# Altium project DAQ_Replacement.PrjPcb (part 2 of 3)

## Sheet MCU_DAQ.SchDoc
size A3
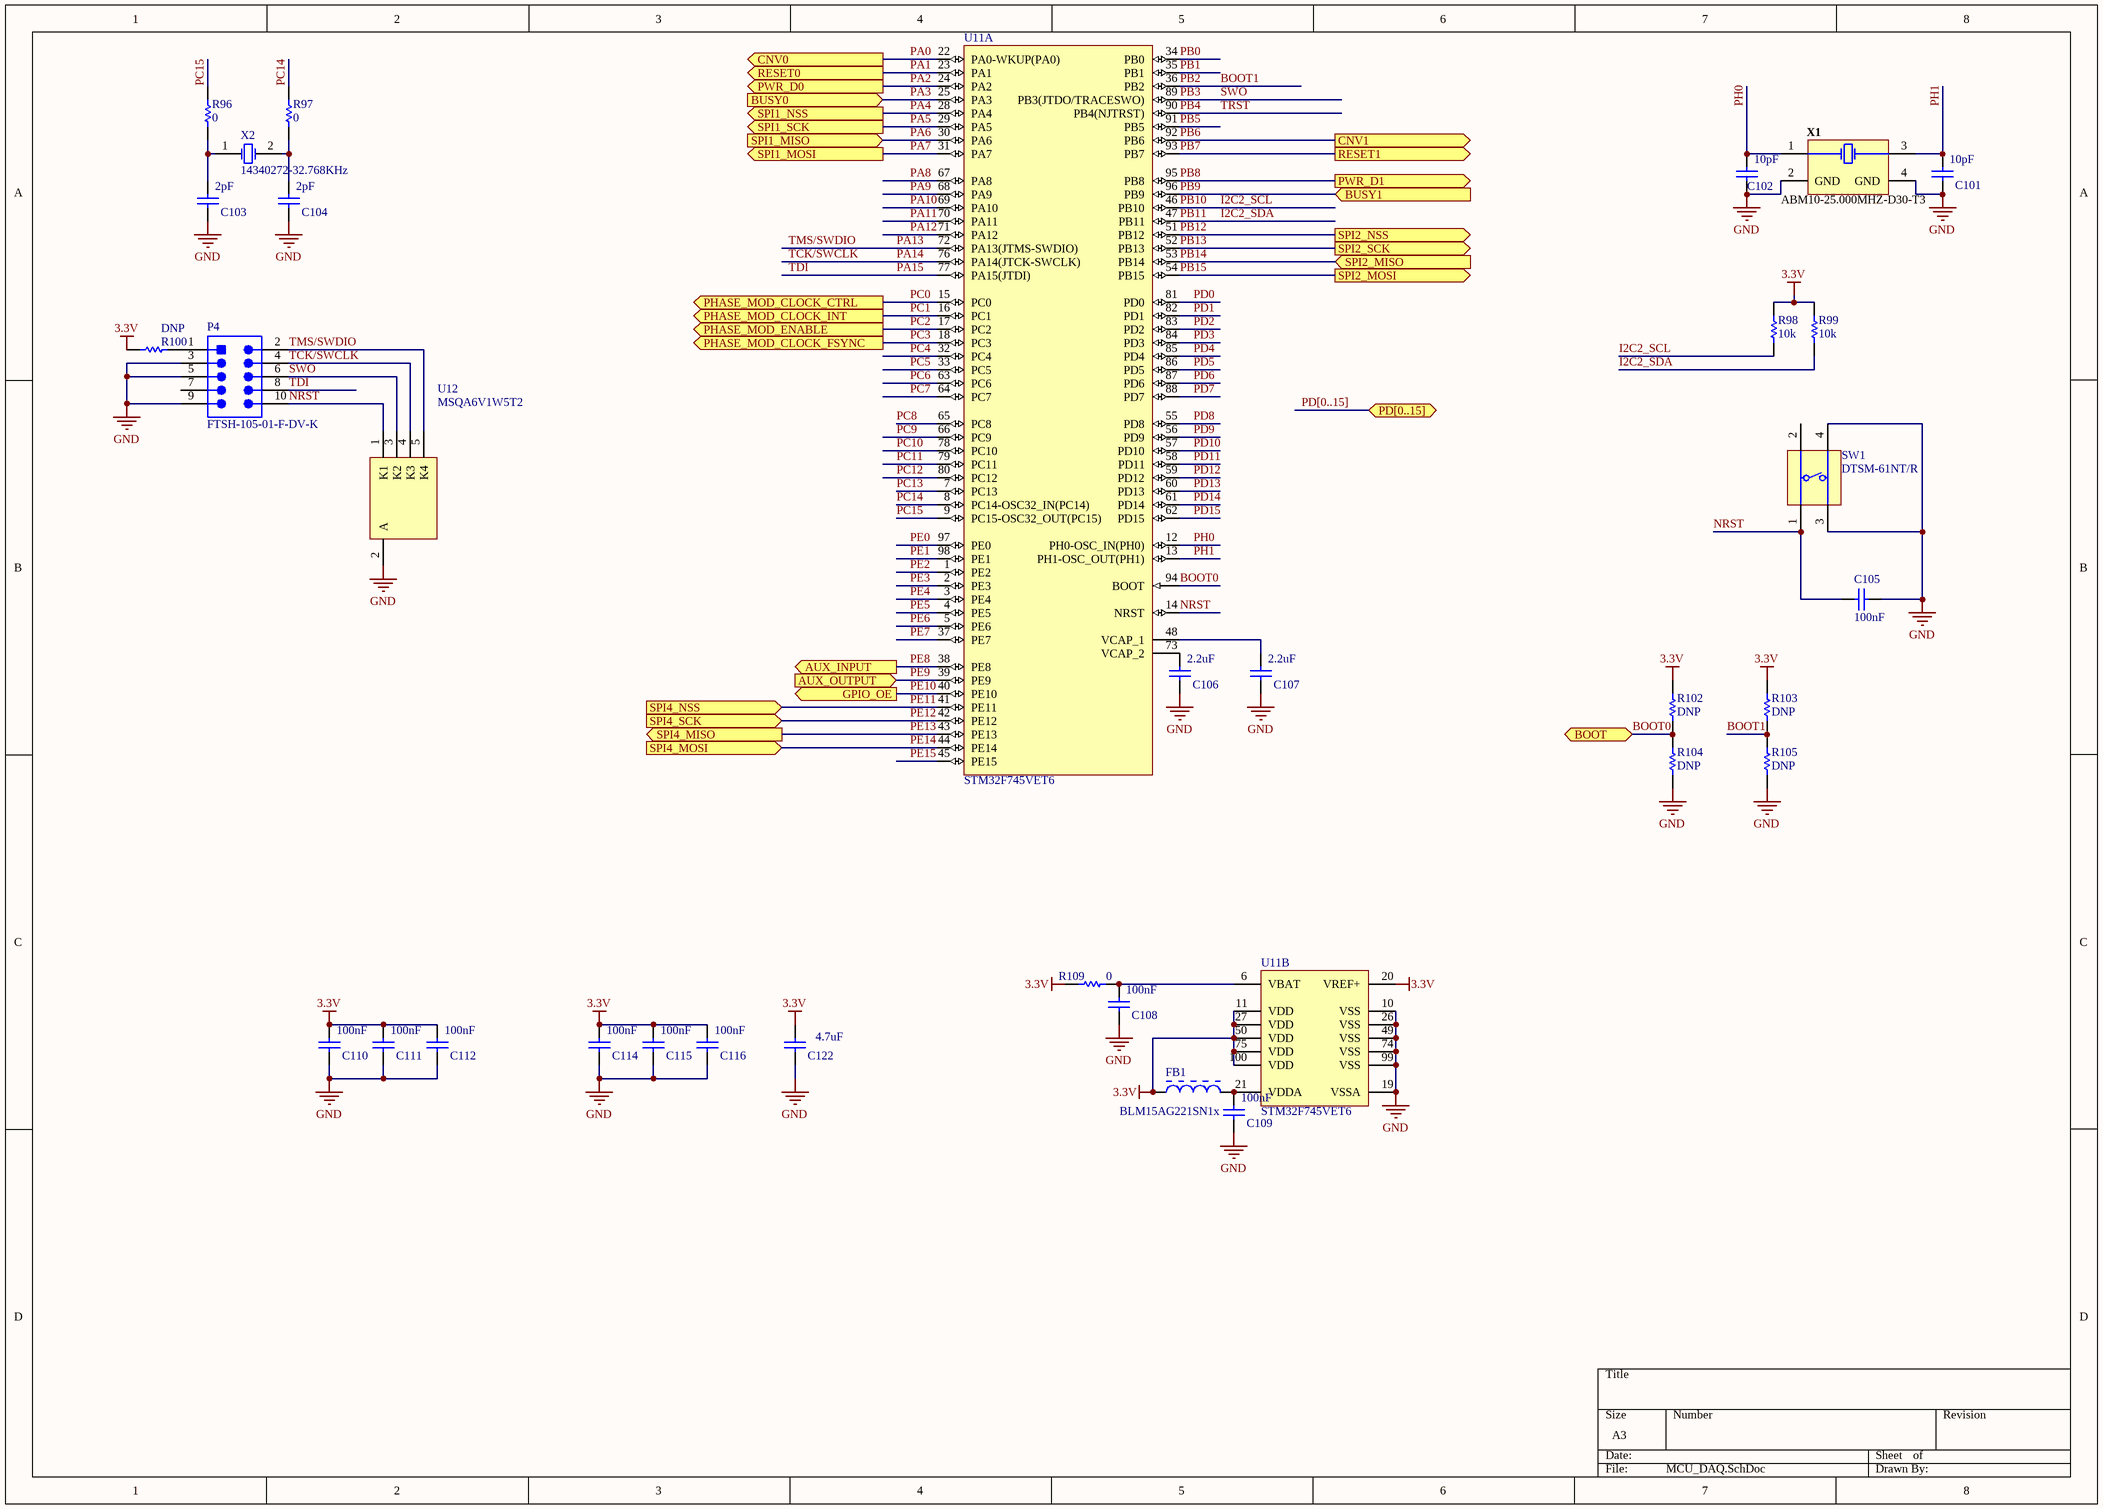
[diagram p8: MCU_DAQ.SchDoc]

### Parts
C101  value 10pF  [CAPC0402(1005)60_L]  (hidden comment: CAP0402)
C102  value 10pF  [CAPC0402(1005)60_L]  (hidden comment: CAP0402)
C103  value 2pF  [CAPC0402(1005)60_L]  (hidden comment: CAP0402)
C104  value 2pF  [CAPC0402(1005)60_L]  (hidden comment: CAP0402)
C105  value 100nF  [CAPC0402(1005)60_L]  (hidden comment: CAP0402)
C106  value 2.2uF  [CAPC0402(1005)60_L]  (hidden comment: CAP0402)
C107  value 2.2uF  [CAPC0402(1005)60_L]  (hidden comment: CAP0402)
C108  value 100nF  [CAPC0402(1005)60_L]  (hidden comment: CAP0402)
C109  value 100nF  [CAPC0402(1005)60_L]  (hidden comment: CAP0402)
C110  value 100nF  [CAPC0402(1005)60_L]  (hidden comment: CAP0402)
C111  value 100nF  [CAPC0402(1005)60_L]  (hidden comment: CAP0402)
C112  value 100nF  [CAPC0402(1005)60_L]  (hidden comment: CAP0402)
C114  value 100nF  [CAPC0402(1005)60_L]  (hidden comment: CAP0402)
C115  value 100nF  [CAPC0402(1005)60_L]  (hidden comment: CAP0402)
C116  value 100nF  [CAPC0402(1005)60_L]  (hidden comment: CAP0402)
C122  value 4.7uF  [CAPC0805(2012)145_L]  (hidden comment: CAP0805)
FB1  BLM15AG221SN1x  [MURA-BLM15AG221SN1x_V]
P4  FTSH-105-01-F-DV-K  [SMTC-FTSH-105-01-L-DV-K_V]
R96  value 0  [RESC0402(1005)_L]  (hidden comment: RES0402)
R97  value 0  [RESC0402(1005)_L]  (hidden comment: RES0402)
R98  value 10k  [RESC0402(1005)_L]  (hidden comment: RES0402)
R99  value 10k  [RESC0402(1005)_L]  (hidden comment: RES0402)
R100  value DNP  [RESC0402(1005)_L]  (hidden comment: RES0402)
R102  value DNP  [RESC0402(1005)_L]  (hidden comment: RES0402)
R103  value DNP  [RESC0402(1005)_L]  (hidden comment: RES0402)
R104  value DNP  [RESC0402(1005)_L]  (hidden comment: RES0402)
R105  value DNP  [RESC0402(1005)_L]  (hidden comment: RES0402)
R109  value 0  [RESC0402(1005)_L]  (hidden comment: RES0402)
SW1  DTSM-61NT/R  [DIPT-DTSM-6_V]
U11  STM32F745VET6  [STM-LQFP100_V]  (parts A,B of 2)
U12  MSQA6V1W5T2  [ONSC-SC70-5-419A-02_V]
X1  ABM10-25.000MHZ-D30-T3  [ABRA-ABM10_V]
X2  14340272-32.768KHz  [ITTI-14340272-32.768KHz-2_V]

### Ports
AUX_INPUT (out), AUX_OUTPUT (in), BOOT, BUSY0 (in), BUSY1 (in), CNV0 (out), CNV1 (out), GPIO_OE (out), PD[0..15] (bidir), PHASE_MOD_CLOCK_CTRL (out), PHASE_MOD_CLOCK_FSYNC (out), PHASE_MOD_CLOCK_INT (out), PHASE_MOD_ENABLE (out), PWR_D0 (out), PWR_D1 (out), RESET0 (out), RESET1 (out), SPI1_MISO (in), SPI1_MOSI (out), SPI1_NSS (out), SPI1_SCK (out), SPI2_MISO (in), SPI2_MOSI (out), SPI2_NSS (out), SPI2_SCK (out), SPI4_MISO (out), SPI4_MOSI (in), SPI4_NSS (in), SPI4_SCK (in)

### Nets
3.3V: C110.1 C111.1 C112.1 C114.1 C115.1 C116.1 C122.2 FB1.1 R98.2 R99.2 R100.2 R102.2 R103.2 R109.2 U11.11(VDD) U11.20(VREF+) U11.27(VDD) U11.50(VDD) U11.75(VDD) U11.100(VDD)
GND: C101.2 C102.2 C103.2 C104.2 C105.2 C106.2 C107.2 C108.2 C109.2 C110.2 C111.2 C112.2 C114.2 C115.2 C116.2 C122.1 P4.3 P4.5 P4.9 R104.1 R105.1 SW1.3(T3) SW1.4(T3) U11.10(VSS) U11.19(VSSA) U11.26(VSS) U11.49(VSS) U11.74(VSS) U11.99(VSS) U12.2(A) X1.2(GND) X1.4(GND)
BOOT0: R102.1 R104.2 U11.94(BOOT) ; port BOOT
BOOT1: R103.1 R105.2 U11.36(PB2)  [also labelled PB2]
I2C2_SCL: R98.1 U11.46(PB10)  [also labelled PB10]
I2C2_SDA: R99.1 U11.47(PB11)  [also labelled PB11]
NRST: C105.1 P4.10 SW1.1(T1) U11.14(NRST) U12.1(K1)
PA0: U11.22(PA0-WKUP(PA0)) ; port CNV0  [project net CNV0]
PA1: U11.23(PA1) ; port RESET0
PA2: U11.24(PA2) ; port PWR_D0
PA3: U11.25(PA3) ; port BUSY0  [project net BUSY0]
PA4: U11.28(PA4) ; port SPI1_NSS  [project net CSB0]
PA5: U11.29(PA5) ; port SPI1_SCK
PA6: U11.30(PA6) ; port SPI1_MISO
PA7: U11.31(PA7) ; port SPI1_MOSI  [project net DIN0]
PA8: U11.67(PA8)
PA9: U11.68(PA9)
PA10: U11.69(PA10)
PA11: U11.70(PA11)
PA12: U11.71(PA12)
PA13: P4.2 U11.72(PA13(JTMS-SWDIO)) U12.5(K4)  [also labelled TMS/SWDIO]
PA14: P4.4 U11.76(PA14(JTCK-SWCLK)) U12.4(K3)  [also labelled TCK/SWCLK]
PA15: P4.8 U11.77(PA15(JTDI))  [also labelled TDI]
PB0: U11.34(PB0)
PB1: U11.35(PB1)
PB3: P4.6 U11.89(PB3(JTDO/TRACESWO)) U12.3(K2)  [also labelled SWO]
PB4: U11.90(PB4(NJTRST))  [also labelled TRST]
PB5: U11.91(PB5)
PB6: U11.92(PB6) ; port CNV1  [project net CNV]
PB7: U11.93(PB7) ; port RESET1
PB8: U11.95(PB8) ; port PWR_D1
PB9: U11.96(PB9) ; port BUSY1  [project net BUSY]
PB12: U11.51(PB12) ; port SPI2_NSS  [project net CSB]
PB13: U11.52(PB13) ; port SPI2_SCK
PB14: U11.53(PB14) ; port SPI2_MISO
PB15: U11.54(PB15) ; port SPI2_MOSI  [project net DIN]
PC0: U11.15(PC0) ; port PHASE_MOD_CLOCK_CTRL
PC1: U11.16(PC1) ; port PHASE_MOD_CLOCK_INT
PC2: U11.17(PC2) ; port PHASE_MOD_ENABLE
PC3: U11.18(PC3) ; port PHASE_MOD_CLOCK_FSYNC
PC4: U11.32(PC4)
PC5: U11.33(PC5)
PC6: U11.63(PC6)
PC7: U11.64(PC7)
PC8: U11.65(PC8)
PC9: U11.66(PC9)
PC10: U11.78(PC10)
PC11: U11.79(PC11)
PC12: U11.80(PC12)
PC13: U11.7(PC13)
PC14: R97.1 U11.8(PC14-OSC32_IN(PC14))
PC15: R96.1 U11.9(PC15-OSC32_OUT(PC15))
PD0: U11.81(PD0)  [project net 3V3_BUS0]
PD1: U11.82(PD1)  [project net 3V3_BUS1]
PD2: U11.83(PD2)  [project net 3V3_BUS2]
PD3: U11.84(PD3)  [project net 3V3_BUS3]
PD4: U11.85(PD4)  [project net 3V3_BUS4]
PD5: U11.86(PD5)  [project net 3V3_BUS5]
PD6: U11.87(PD6)  [project net 3V3_BUS6]
PD7: U11.88(PD7)  [project net 3V3_BUS7]
PD8: U11.55(PD8)  [project net 3V3_BUS8]
PD9: U11.56(PD9)  [project net 3V3_BUS9]
PD10: U11.57(PD10)  [project net 3V3_BUS10]
PD11: U11.58(PD11)  [project net 3V3_BUS11]
PD12: U11.59(PD12)  [project net 3V3_BUS12]
PD13: U11.60(PD13)  [project net 3V3_BUS13]
PD14: U11.61(PD14)  [project net 3V3_BUS14]
PD15: U11.62(PD15)  [project net 3V3_BUS15]
PE0: U11.97(PE0)
PE1: U11.98(PE1)
PE2: U11.1(PE2)
PE3: U11.2(PE3)
PE4: U11.3(PE4)
PE5: U11.4(PE5)
PE6: U11.5(PE6)
PE7: U11.37(PE7)
PE8: U11.38(PE8) ; port AUX_INPUT
PE9: U11.39(PE9) ; port AUX_OUTPUT
PE10: U11.40(PE10) ; port GPIO_OE  [project net GPIO_OE]
PE11: U11.41(PE11) ; port SPI4_NSS
PE12: U11.42(PE12) ; port SPI4_SCK
PE13: U11.43(PE13) ; port SPI4_MISO  [project net MISO]
PE14: U11.44(PE14) ; port SPI4_MOSI  [project net MOSI]
PE15: U11.45(PE15)
PH0: C102.1 U11.12(PH0-OSC_IN(PH0)) X1.1(X1)
PH1: C101.1 U11.13(PH1-OSC_OUT(PH1)) X1.3(X2)
NetC103_1: C103.1 R96.2 X2.1(X1)
NetC104_1: C104.1 R97.2 X2.2(X2)
NetC106_1: C106.1 U11.73(VCAP_2)
NetC107_1: C107.1 U11.48(VCAP_1)
NetC108_1: C108.1 R109.1 U11.6(VBAT)
NetC109_1: C109.1 FB1.2 U11.21(VDDA)
NetP4_1: P4.1 R100.1

Not connected (* = marked no-connect by the designer): P4 7; SW1 2(T2)

### Buses and harness runs
bus PD[0..15] = port PD[0..15]

### Library data of the parts
C101-C112 C114-C116 = CMP-1590-00004-1: as C14 on sheet ADC_Sheet; PackageReference: CAPC0402(1005)60
C122 = CMP-1590-00003-1: as C13 on sheet ADC_Sheet; PackageReference: CAPC0805(2012)145
FB1 = CMP-1662-00018-3: as FB3 on sheet Bipolar_PSU_Sheet; Package Quantity: 10000; DatasheetVersion: 03/2011; Radiation Hardening: No; Case Code (Imperial): 0402; Length: 1 mm; RoHSCompliant: True; ComponentLink1URL: http://www.murata.com/; Case/Package: 0402; Width: 0.5 mm; Mounting Technology: Surface Mount; REACH SVHC: No SVHC; Height: 0.5 mm; ComponentLink2Description: Datasheet; PartNumber: BLM15AG221SN1x; ComponentLink1Description: Manufacturer URL; Max Operating Temperature: 125 degC; PackageDescription: 2-Pin Surface Mount Device, Body 1 x 0.5 mm; Case Code (Metric): 1005; ComponentLink2URL: https://datasheet.ciiva.com/11800/0900766b811b5866-11800858.pdf; Min Operating Temperature: -55 degC
P4 = CMP-2000-05352-1: as P8 on sheet WIFI_BLE_Option; Fastening Type: -; Package Reference: FTSH-105-01-L-DV-K; Termination: Solder; Package URL: http://suddendocs.samtec.com/prints/ftsh-1xx-xx-xxx-dv-xxx-footprint.pdf; Number of Rows: 2; Contact Finish Thickness: 3µin(0.08µm); Contact Type: MalePin; Manufacturer URL: http://www.samtec.com/; Contact Mating Length: 0.120"(3.05mm); Pitch: 0.050"(1.27mm); Series: FTSH; Features: -; Contact Finish: Gold; Color: Black; Family: RectangularConnectors-Headers,MalePins; Datasheet URL: http://suddendocs.samtec.com/prints/ftsh-1xx-xx-xxx-dv-xxx-mkt.pdf; Package Description: Male Header, Pitch 1.27 mm, 2 x 5 Position, Height 5.97 mm, Tail Length 4.32 mm; Mounting Type: SurfaceMount; Datasheet Version: Rev. ET, 10/1995; Category: Connectors,Interconnects; Packaging: Tube
R96-R100 R102-R105 R109 = CMP-1591-00004-1: as R236 on sheet USB; PackageReference: RESC0402(1005)
SW1 = CMP-0306-00001-1: Switch, SPNO Push Button SMD; Manufacturer: Diptronics; Packing Type: Tape&Reel; Mechanical Life: 200,000 cycles; ComponentLink2URL: http://www.dip.com.tw/Products_tact.htm; ComponentLink1URL: http://www.dip.com.tw/; ComponentLink3URL: http://www.dip.com.tw/PDF/pro_tact/DTSM_G_-6_2_-V.pdf; PackageDescription: Switch, Through-Hole, 4 Leads, Body 8.5x8.5mm, Row Spacing 9.0mm, Pitch 4.5mm; ComponentLink2Description: Datasheet; ComponentLink3Description: Package Specification; ComponentLink1Description: Manufacturer URL; PackageReference: DTSM-6; PartNumber: DTSM-61NT/R; Mounting Technology: Through Hole
U11 = CMP-1570-00003-1: ARM-Based Cortex-M7 32 Bit MCU+FPU, 462 DMIPS, 512 kB Flash, 320 kB RAM, 82 I/Os, -40 to 85 degC, 100-Pin LQFP, Halogen-Free, Tray; L1 Cache Data Memory: 4 KByte; Supply Voltage Max: 3.6 V; Supply Voltage Min: 1.7 V; Number of I/Os: 82; Clock Frequency Max: 216 MHz; Program Memory Size: 512 KByte; Data RAM Size: 320 KByte; DatasheetVersion: Rev. 1; ComponentLink3Description: Package Specification; L1 Cache Instruction Memory: 4 KByte; ComponentLink1Description: Manufacturer URL; Mounting Technology: Surface Mount; Packing: Tray; ComponentLink3URL: http://www.st.com/st-web-ui/static/active/en/resource/technical/document/data_brief/DM00071938.pdf; ComponentLink2URL: http://www.st.com/st-web-ui/static/active/en/resource/technical/document/datasheet/DM00166116.pdf; ComponentLink1URL: http://www.st.com/web/en/home.html; Temperature Min: -40 degC; ComponentLink2Description: Datasheet; PackageDescription: 100-Pin Low Profile Quad Flat Package, 14 x 14 mm Body, 0.5 mm Pitch; Temperature Max: 85 degC; PartNumber: STM32F745VE
U12 = CMP-1060-00060-1: as U41 on sheet USB; Packing: Tape and Reel; DatasheetVersion: Rev. 7; ComponentLink2URL: http://www.onsemi.com/pub_link/Collateral/MSQA6V1W5T2-D.PDF; PackageDescription: 5-Pin Small Outline Transistor, Body 2 x 1.25 mm, Pitch 0.65 mm; PackageVersion: Rev. L, 01/2013; ComponentLink1URL: http://www.onsemi.com/; ComponentLink2Description: Datasheet; ComponentLink3Description: Package Specification; Mounting Technology: Surface Mount; ComponentLink1Description: Manufacturer URL; PackageReference: SC70-5-419A-02; PartNumber: MSQA6V1W5T2; ComponentLink3URL: http://www.onsemi.cn/pub_link/Collateral/419A-02.PDF
X1 = CMP-2000-05727-1: Ceramic SMD Ultra Miniature Quartz Crystal, 25 MHz, 100 Ohm, 10 pF, -40 to 85 degC, 4-Pin SMD, RoHS, Tape and Reel; Manufacturer: ABRACON; Case Width: 2mm; Case Length: 2.5mm; Frequency: 25MHz; ESR: 100Ohms; Load Capacitance: 10pF; Case Height: 0.5mm; Tolerance: 20PPM; Frequency Stability: 30PPM; Manufacturer URL: http://www.abracon.com/; Datasheet URL: https://datasheet.ciiva.com/4946/abm10-31166-4946144.pdf; Type: UltraMiniatureQuartzCrystal; Series: ABM10; Mounting Style: SMD/SMT; Operating Temperature Range: -40Cto+85C; Mounting Technology: SurfaceMount; Factory Pack Quantity: 3000; Datasheet Version: 01/2013; Packaging: Reel; Brand: ABRACON; Package Description: 4-Pin Surface Mount Device, Body 2 x 2.5 mm, Pitch 1.65 mm; Termination Style: SMD/SMT; Product Category: Crystals; Package / Case: 2.5mmx2mmx0.5mm; Dimensions: 2mmWx2.5mmLx0.5mmH; RoHS: Details; Package Reference: ABM10
X2 = CMP-0463-00001-2: Crystal, 32.768 KHz, -40 to 85 degC, 3.2 x 1.5 x 0.9 mm SMD; Manufacturer: ITTI; Load Capacitance: 12.5 pF; Frequency Tolerance: +/-20 ppm; Drive Level: 1 max. uw; Nominal Frequency: 32.768KHz; Mounting Technology: Surface Mount; Operating temperature: -40 to 85 degC; PartNumber: 14340272-32.768KHz; ComponentLink1URL: http://www.itti-co.com; ComponentLink1Description: Manufacturer URL; PackageReference: 14340272-32.768KHz-2; PackageDescription: 2-Pin Hand Drawn, Body 3.2 x 1.5mm, Pitch 2.5 mm

## Sheet MCU_USB.SchDoc
size A3
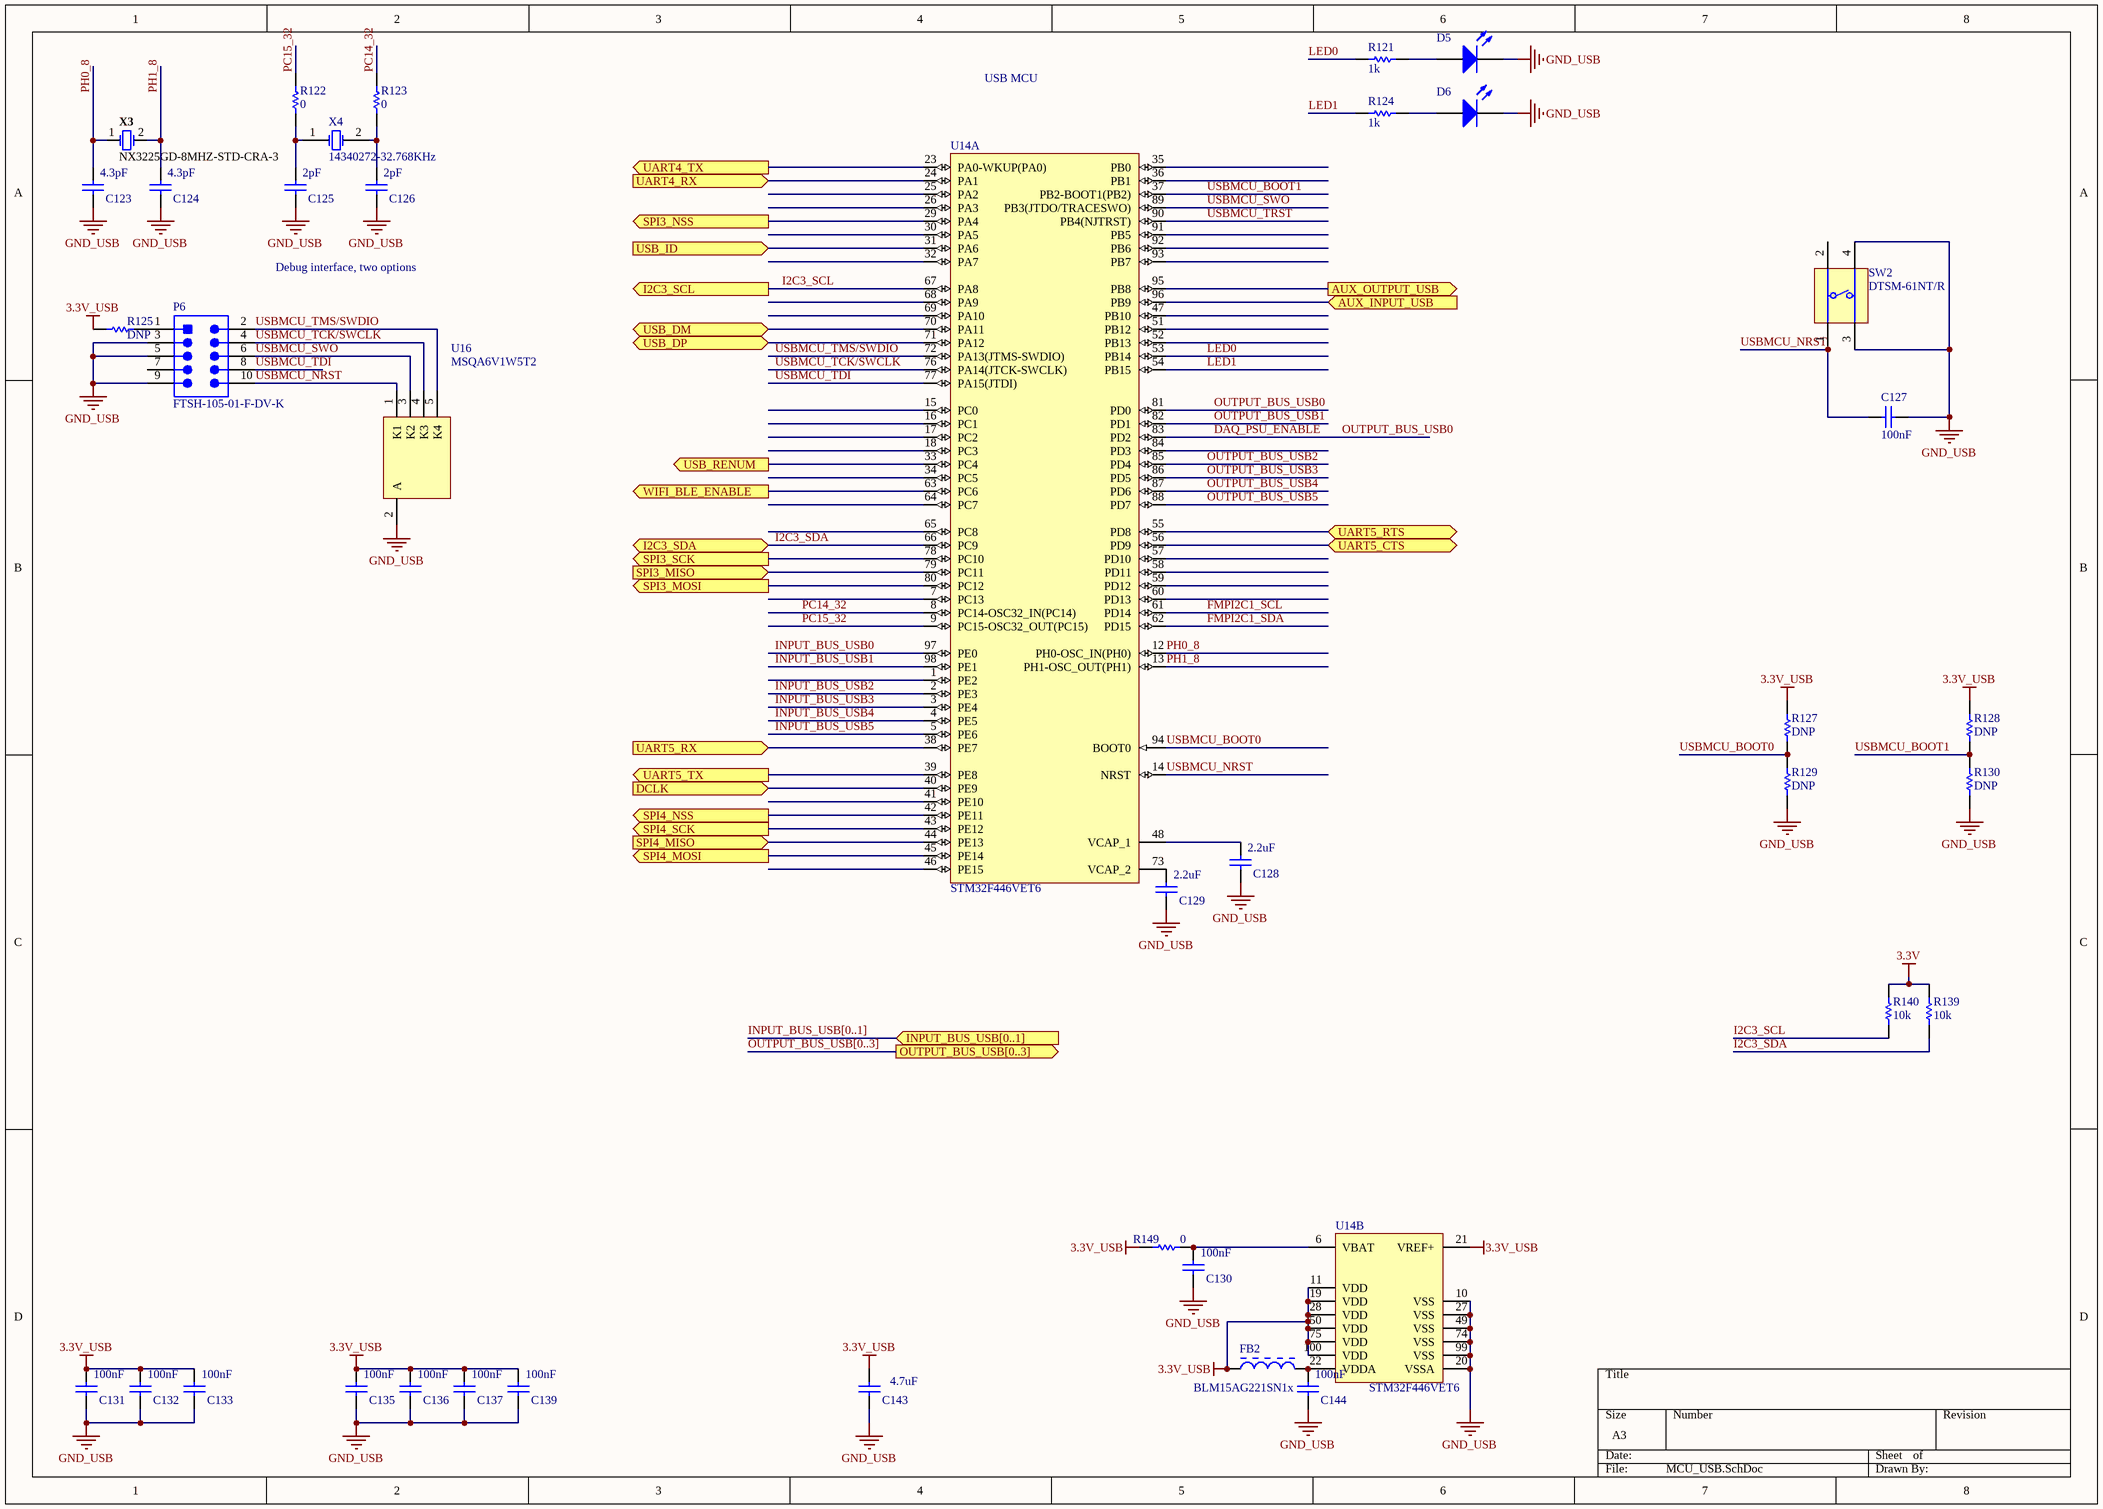
[diagram p9: MCU_USB.SchDoc]

### Parts
C123  value 4.3pF  [CAPC0402(1005)60_L]  (hidden comment: CAP0402)
C124  value 4.3pF  [CAPC0402(1005)60_L]  (hidden comment: CAP0402)
C125  value 2pF  [CAPC0402(1005)60_L]  (hidden comment: CAP0402)
C126  value 2pF  [CAPC0402(1005)60_L]  (hidden comment: CAP0402)
C127  value 100nF  [CAPC0402(1005)60_L]  (hidden comment: CAP0402)
C128  value 2.2uF  [CAPC0402(1005)60_L]  (hidden comment: CAP0402)
C129  value 2.2uF  [CAPC0402(1005)60_L]  (hidden comment: CAP0402)
C130  value 100nF  [CAPC0402(1005)60_L]  (hidden comment: CAP0402)
C131  value 100nF  [CAPC0402(1005)60_L]  (hidden comment: CAP0402)
C132  value 100nF  [CAPC0402(1005)60_L]  (hidden comment: CAP0402)
C133  value 100nF  [CAPC0402(1005)60_L]  (hidden comment: CAP0402)
C135  value 100nF  [CAPC0402(1005)60_L]  (hidden comment: CAP0402)
C136  value 100nF  [CAPC0402(1005)60_L]  (hidden comment: CAP0402)
C137  value 100nF  [CAPC0402(1005)60_L]  (hidden comment: CAP0402)
C139  value 100nF  [CAPC0402(1005)60_L]  (hidden comment: CAP0402)
C143  value 4.7uF  [CAPC0805(2012)145_L]  (hidden comment: CAP0805)
C144  value 100nF  [CAPC0402(1005)60_L]  (hidden comment: CAP0402)
D5  Green_LED_150060GS75000  [Green_LED_150060GS75000]  (value not drawn)
D6  Green_LED_150060GS75000  [Green_LED_150060GS75000]  (value not drawn)
FB2  BLM15AG221SN1x  [MURA-BLM15AG221SN1x_V]
P6  FTSH-105-01-F-DV-K  [SMTC-FTSH-105-01-L-DV-K_V]
R121  value 1k  [RESC0402(1005)_L]  (hidden comment: RES0402)
R122  value 0  [RESC0402(1005)_L]  (hidden comment: RES0402)
R123  value 0  [RESC0402(1005)_L]  (hidden comment: RES0402)
R124  value 1k  [RESC0402(1005)_L]  (hidden comment: RES0402)
R125  value DNP  [RESC0402(1005)_L]  (hidden comment: RES0402)
R127  value DNP  [RESC0402(1005)_L]  (hidden comment: RES0402)
R128  value DNP  [RESC0402(1005)_L]  (hidden comment: RES0402)
R129  value DNP  [RESC0402(1005)_L]  (hidden comment: RES0402)
R130  value DNP  [RESC0402(1005)_L]  (hidden comment: RES0402)
R139  value 10k  [RESC0402(1005)_L]  (hidden comment: RES0402)
R140  value 10k  [RESC0402(1005)_L]  (hidden comment: RES0402)
R149  value 0  [RESC0402(1005)_L]  (hidden comment: RES0402)
SW2  DTSM-61NT/R  [DIPT-DTSM-6_V]
U14  STM32F446VET6  [STM-LQFP100_M]  (parts A,B of 2)
U16  MSQA6V1W5T2  [ONSC-SC70-5-419A-02_V]
X3  NX3225GD-8MHZ-STD-CRA-3  [NDK-NX3225GD-8MHZ-STD-CRA-3_V]
X4  14340272-32.768KHz  [ITTI-14340272-32.768KHz-2_V]

### Ports
AUX_INPUT_USB (in), AUX_OUTPUT_USB (out), DCLK (in), I2C3_SCL (out), I2C3_SDA (bidir), INPUT_BUS_USB[0..1] (in), OUTPUT_BUS_USB[0..3] (out), SPI3_MISO (in), SPI3_MOSI (out), SPI3_NSS (out), SPI3_SCK (out), SPI4_MISO (in), SPI4_MOSI (out), SPI4_NSS (out), SPI4_SCK (out), UART4_RX (in), UART4_TX (out), UART5_CTS (bidir), UART5_RTS (bidir), UART5_RX (in), UART5_TX (out), USB_DM (bidir), USB_DP (bidir), USB_ID (in), USB_RENUM (out), WIFI_BLE_ENABLE (out)

### Nets
3.3V: R139.2 R140.2
3.3V_USB: C131.1 C132.1 C133.1 C135.1 C136.1 C137.1 C139.1 C143.2 FB2.1 R125.2 R127.2 R128.2 R149.2 U14.11(VDD) U14.19(VDD) U14.21(VREF+) U14.28(VDD) U14.50(VDD) U14.75(VDD) U14.100(VDD)
GND_USB: C123.2 C124.2 C125.2 C126.2 C127.2 C128.2 C129.2 C130.2 C131.2 C132.2 C133.2 C135.2 C136.2 C137.2 C139.2 C143.1 C144.2 D5.1 D6.1 P6.3 P6.5 P6.9 R129.1 R130.1 SW2.3(T3) SW2.4(T3) U14.10(VSS) U14.20(VSSA) U14.27(VSS) U14.49(VSS) U14.74(VSS) U14.99(VSS) U16.2(A)
DAQ_PSU_ENABLE: U14.81(PD0) U14.83(PD2)  [also labelled OUTPUT_BUS_USB0]
FMPI2C1_SCL: U14.61(PD14)
FMPI2C1_SDA: U14.62(PD15)
I2C3_SCL: R140.1 U14.67(PA8) ; port I2C3_SCL
I2C3_SDA: R139.1 U14.66(PC9) ; port I2C3_SDA
INPUT_BUS_USB0: U14.97(PE0)
INPUT_BUS_USB1: U14.98(PE1)
INPUT_BUS_USB2: U14.2(PE3)
INPUT_BUS_USB3: U14.3(PE4)
INPUT_BUS_USB4: U14.4(PE5)
INPUT_BUS_USB5: U14.5(PE6)
LED0: R121.1 U14.53(PB14)
LED1: R124.1 U14.54(PB15)
OUTPUT_BUS_USB1: U14.82(PD1)
OUTPUT_BUS_USB2: U14.85(PD4)
OUTPUT_BUS_USB3: U14.86(PD5)
OUTPUT_BUS_USB4: U14.87(PD6)
OUTPUT_BUS_USB5: U14.88(PD7)
PC14_32: R123.1 U14.8(PC14-OSC32_IN(PC14))
PC15_32: R122.1 U14.9(PC15-OSC32_OUT(PC15))
PH0_8: C123.1 U14.12(PH0-OSC_IN(PH0)) X3.1
PH1_8: C124.1 U14.13(PH1-OSC_OUT(PH1)) X3.2
SPI_CS_WIFI_BLE: U14.29(PA4) ; port SPI3_NSS
SPI_MISO_WIFI_BLE: U14.79(PC11) ; port SPI3_MISO
SPI_MOSI_WIFI_BLE: U14.80(PC12) ; port SPI3_MOSI
SPI_SCLK_WIFI_BLE: U14.78(PC10) ; port SPI3_SCK
UART_CTS_WIFI_BLE: U14.56(PD9) ; port UART5_CTS
UART_RTS_WIFI_BLE: U14.55(PD8) ; port UART5_RTS
UART_RX_WIFI_BLE: U14.39(PE8) ; port UART5_TX
UART_TX_WIFI_BLE: U14.38(PE7) ; port UART5_RX
USB_ID: U14.31(PA6) ; port USB_ID
USB_RENUM: U14.33(PC4) ; port USB_RENUM
USBMCU_BOOT0: R127.1 R129.2 U14.94(BOOT0)
USBMCU_BOOT1: R128.1 R130.2 U14.37(PB2-BOOT1(PB2))
USBMCU_NRST: C127.1 P6.10 SW2.1(T1) U14.14(NRST) U16.1(K1)
USBMCU_SWO: P6.6 U14.89(PB3(JTDO/TRACESWO)) U16.3(K2)
USBMCU_TCK/SWCLK: P6.4 U14.76(PA14(JTCK-SWCLK)) U16.4(K3)
USBMCU_TDI: P6.8 U14.77(PA15(JTDI))
USBMCU_TMS/SWDIO: P6.2 U14.72(PA13(JTMS-SWDIO)) U16.5(K4)
USBMCU_TRST: U14.90(PB4(NJTRST))
WIFI_BLE_ENABLE: U14.63(PC6) ; port WIFI_BLE_ENABLE
NetC125_1: C125.1 R122.2 X4.1(X1)
NetC126_1: C126.1 R123.2 X4.2(X2)
NetC128_1: C128.1 U14.48(VCAP_1)
NetC129_1: C129.1 U14.73(VCAP_2)
NetC130_1: C130.1 R149.1 U14.6(VBAT)
NetC144_1: C144.1 FB2.2 U14.22(VDDA)
NetD5_2: D5.2 R121.2
NetD6_2: D6.2 R124.2
NetJ4_2: U14.70(PA11) ; port USB_DM
NetJ4_3: U14.71(PA12) ; port USB_DP
NetP6_1: P6.1 R125.1
NetU14_23: U14.23(PA0-WKUP(PA0)) ; port UART4_TX
NetU14_24: U14.24(PA1) ; port UART4_RX
NetU14_40: U14.40(PE9) ; port DCLK
NetU14_42: U14.42(PE11) ; port SPI4_NSS
NetU14_43: U14.43(PE12) ; port SPI4_SCK
NetU14_44: U14.44(PE13) ; port SPI4_MISO
NetU14_45: U14.45(PE14) ; port SPI4_MOSI
NetU14_95: U14.95(PB8) ; port AUX_OUTPUT_USB
NetU14_96: U14.96(PB9) ; port AUX_INPUT_USB

Not connected (* = marked no-connect by the designer): P6 7; SW2 2(T2); U14 1(PE2) 7(PC13) 15(PC0) 16(PC1) 17(PC2) 18(PC3) 25(PA2) 26(PA3) 30(PA5) 32(PA7) 34(PC5) 35(PB0) 36(PB1) 41(PE10) 46(PE15) 47(PB10) 51(PB12) 52(PB13) 57(PD10) 58(PD11) 59(PD12) 60(PD13) 64(PC7) 65(PC8) 68(PA9) 69(PA10) 84(PD3) 91(PB5) 92(PB6) 93(PB7)

### Buses and harness runs
bus INPUT_BUS_USB[0..1] = port INPUT_BUS_USB[0..1]
bus OUTPUT_BUS_USB[0..3] = port OUTPUT_BUS_USB[0..3]

### Notes on the sheet
- USB MCU
- Debug interface, two options

### Library data of the parts
C123-C133 C135-C137 C139 C144 = CMP-1590-00004-1: 0402 (1005 Metric) Chip Capacitor; Case-EIA: 0402; Case-Metric: 1005; PackageReference: CAPC0402(1005)60
C143 = CMP-1590-00003-1: 0805 (2012 Metric) Chip Capacitor; Case-EIA: 0805; Case-Metric: 2012; PackageReference: CAPC0805(2012)145
D5 D6 = Green_LED_150060GS75000: WURTH ELEKTRONIK  150060GS75000  LED, Green, SMD, 30 mA, 3.2 V, 520 nm; Unit Cost: 0.287; ComponentLinkURL1: http://ie.farnell.com/wurth-elektronik/150060gs75000/led-0603-green-430mcd-520nm/dp/2322070?ost=150060GS75000&selectedCategoryId=&categoryNameResp=All%2BCategories&searchView=table&iscrfnonsku=false; Manufacturer Part Number: 150060GS75000; Supplier 1: Farnell; Supplier Part Number 1: 2322070; Manufacturer: WURTH ELEKTRONIK
FB2 = CMP-1662-00018-3: Chip Bead, 220 Ohm, +/- 25 %, 100 MHz, 300 mA, -55 to 125 degC, 0402 (1005 Metric), RoHS; Tolerance: 25%; Current Rating: 200 mA; Max Current Rating: 450 mA; Resistance: 220 Ohm; Package Quantity: 10000; DatasheetVersion: 03/2011; Radiation Hardening: No; Case Code (Imperial): 0402; Length: 1 mm; RoHSCompliant: True; ComponentLink1URL: http://www.murata.com/; Case/Package: 0402; Width: 0.5 mm; Mounting Technology: Surface Mount; REACH SVHC: No SVHC; Height: 0.5 mm; ComponentLink2Description: Datasheet; PartNumber: BLM15AG221SN1x; ComponentLink1Description: Manufacturer URL; Max Operating Temperature: 125 degC; PackageDescription: 2-Pin Surface Mount Device, Body 1 x 0.5 mm; Case Code (Metric): 1005; ComponentLink2URL: https://datasheet.ciiva.com/11800/0900766b811b5866-11800858.pdf; Min Operating Temperature: -55 degC
P6 = CMP-2000-05352-1: Male Header, Pitch 1.27 mm, 2 x 5 Position, Height 6.12 mm, RoHS, Tube; Manufacturer: Samtec; Number of Positions: 10; Connector Type: Header,Shrouded; Number of Positions Loaded: All; Row Spacing: 0.050"(1.27mm); Fastening Type: -; Package Reference: FTSH-105-01-L-DV-K; Termination: Solder; Package URL: http://suddendocs.samtec.com/prints/ftsh-1xx-xx-xxx-dv-xxx-footprint.pdf; Number of Rows: 2; Contact Finish Thickness: 3µin(0.08µm); Contact Type: MalePin; Manufacturer URL: http://www.samtec.com/; Contact Mating Length: 0.120"(3.05mm); Pitch: 0.050"(1.27mm); Series: FTSH; Features: -; Contact Finish: Gold; Color: Black; Family: RectangularConnectors-Headers,MalePins; Datasheet URL: http://suddendocs.samtec.com/prints/ftsh-1xx-xx-xxx-dv-xxx-mkt.pdf; Package Description: Male Header, Pitch 1.27 mm, 2 x 5 Position, Height 5.97 mm, Tail Length 4.32 mm; Mounting Type: SurfaceMount; Datasheet Version: Rev. ET, 10/1995; Category: Connectors,Interconnects; Packaging: Tube
R121-R125 R127-R130 R139 R140 R149 = CMP-1591-00004-1: 0402 (1005 Metric) Chip Resistor; Case-EIA: 0402; Case-Metric: 1005; PackageReference: RESC0402(1005)
SW2 = CMP-0306-00001-1: Switch, SPNO Push Button SMD; Manufacturer: Diptronics; Packing Type: Tape&Reel; Mechanical Life: 200,000 cycles; ComponentLink2URL: http://www.dip.com.tw/Products_tact.htm; ComponentLink1URL: http://www.dip.com.tw/; ComponentLink3URL: http://www.dip.com.tw/PDF/pro_tact/DTSM_G_-6_2_-V.pdf; PackageDescription: Switch, Through-Hole, 4 Leads, Body 8.5x8.5mm, Row Spacing 9.0mm, Pitch 4.5mm; ComponentLink2Description: Datasheet; ComponentLink3Description: Package Specification; ComponentLink1Description: Manufacturer URL; PackageReference: DTSM-6; PartNumber: DTSM-61NT/R; Mounting Technology: Through Hole
U14 = CMP-0243-00220-1: ARM Cortex-M4 32-bit MCU+FPU, 512 KB Flash, 128 KB Internal RAM, 81 I/Os, 100-Pin LQFP, -40 to 85 degC, Tray; I/Os (High Current): 81; D/A Converter: 2; Internal RAM Size (kB): 128; FLASH Size (Prog) (kB): 512; Supply Voltage(Vcc) min (V): 1.7; Operating Frequency(F) (Processor speed) (MHz): 180; ComponentLink1Description: Manufacturer URL; ComponentLink1URL: http://www.st.com/; Core: ARM Cortex-M4; DatasheetVersion: Rev. 6; ComponentLink2Description: Datasheet; Package Description: LQFP100; Mounting Technology: Surface Mount; Package Reference: 100-Pin Low Profile Quad Flat Package, Body 14 x 14 mm, Pitch 0.5 mm; Packing: Tray; ComponentLink2URL: http://www.st.com/st-web-ui/static/active/en/resource/technical/document/datasheet/DM00141306.pdf
U16 = CMP-1060-00060-1: Quad Array ESD Protection Diodes with Low Clamping Voltage, 5-Pin SC70, Tape and Reel; Manufacturer: On Semiconductor; P Max (W): 0.385; Packing: Tape and Reel; DatasheetVersion: Rev. 7; ComponentLink2URL: http://www.onsemi.com/pub_link/Collateral/MSQA6V1W5T2-D.PDF; PackageDescription: 5-Pin Small Outline Transistor, Body 2 x 1.25 mm, Pitch 0.65 mm; PackageVersion: Rev. L, 01/2013; ComponentLink1URL: http://www.onsemi.com/; ComponentLink2Description: Datasheet; ComponentLink3Description: Package Specification; Mounting Technology: Surface Mount; ComponentLink1Description: Manufacturer URL; PackageReference: SC70-5-419A-02; PartNumber: MSQA6V1W5T2; ComponentLink3URL: http://www.onsemi.cn/pub_link/Collateral/419A-02.PDF
X3 = CMP-2000-07595-1: Crystal Unit, 8 MHz, 8 pF, -40 to 150 degC, 2-Pin SMD, RoHS, Tape and Reel; Manufacturer: NDK; Load Capacitance: 8pF; ESR (Equivalent Series Resistance): 500Ohm; Frequency Tolerance: 50ppm; Frequency Stability: 150ppm; Frequency: 8MHz; Case/Package: SMD/SMT; Datasheet Version: 11/2016; Min Operating Temperature: -40degC; Packaging: TapeandReel; Width: 0.098inch; Package Quantity: 3000; Number of Pins: 2; Package Description: 2-Pin Surface Mount Device, Body 3.2 x 2.5 mm; RoHSCompliant: True; Package Reference: NX3225GD-8MHZ-STD-CRA-3; Datasheet URL: http://www.ndk.com/images/products/catalog/c_NX3225GD-STD-CRA-3_e.pdf; Mounting Technology: SurfaceMount; Length: 0.126inch; Mount: SurfaceMount; Manufacturer URL: http://www.ndk.com/en/; Max Operating Temperature: 150degC; Height: 0.039inch
X4 = CMP-0463-00001-2: Crystal, 32.768 KHz, -40 to 85 degC, 3.2 x 1.5 x 0.9 mm SMD; Manufacturer: ITTI; Load Capacitance: 12.5 pF; Frequency Tolerance: +/-20 ppm; Drive Level: 1 max. uw; Nominal Frequency: 32.768KHz; Mounting Technology: Surface Mount; Operating temperature: -40 to 85 degC; PartNumber: 14340272-32.768KHz; ComponentLink1URL: http://www.itti-co.com; ComponentLink1Description: Manufacturer URL; PackageReference: 14340272-32.768KHz-2; PackageDescription: 2-Pin Hand Drawn, Body 3.2 x 1.5mm, Pitch 2.5 mm

## Sheet Phase_Modulator_Transmitter.SchDoc
size A4
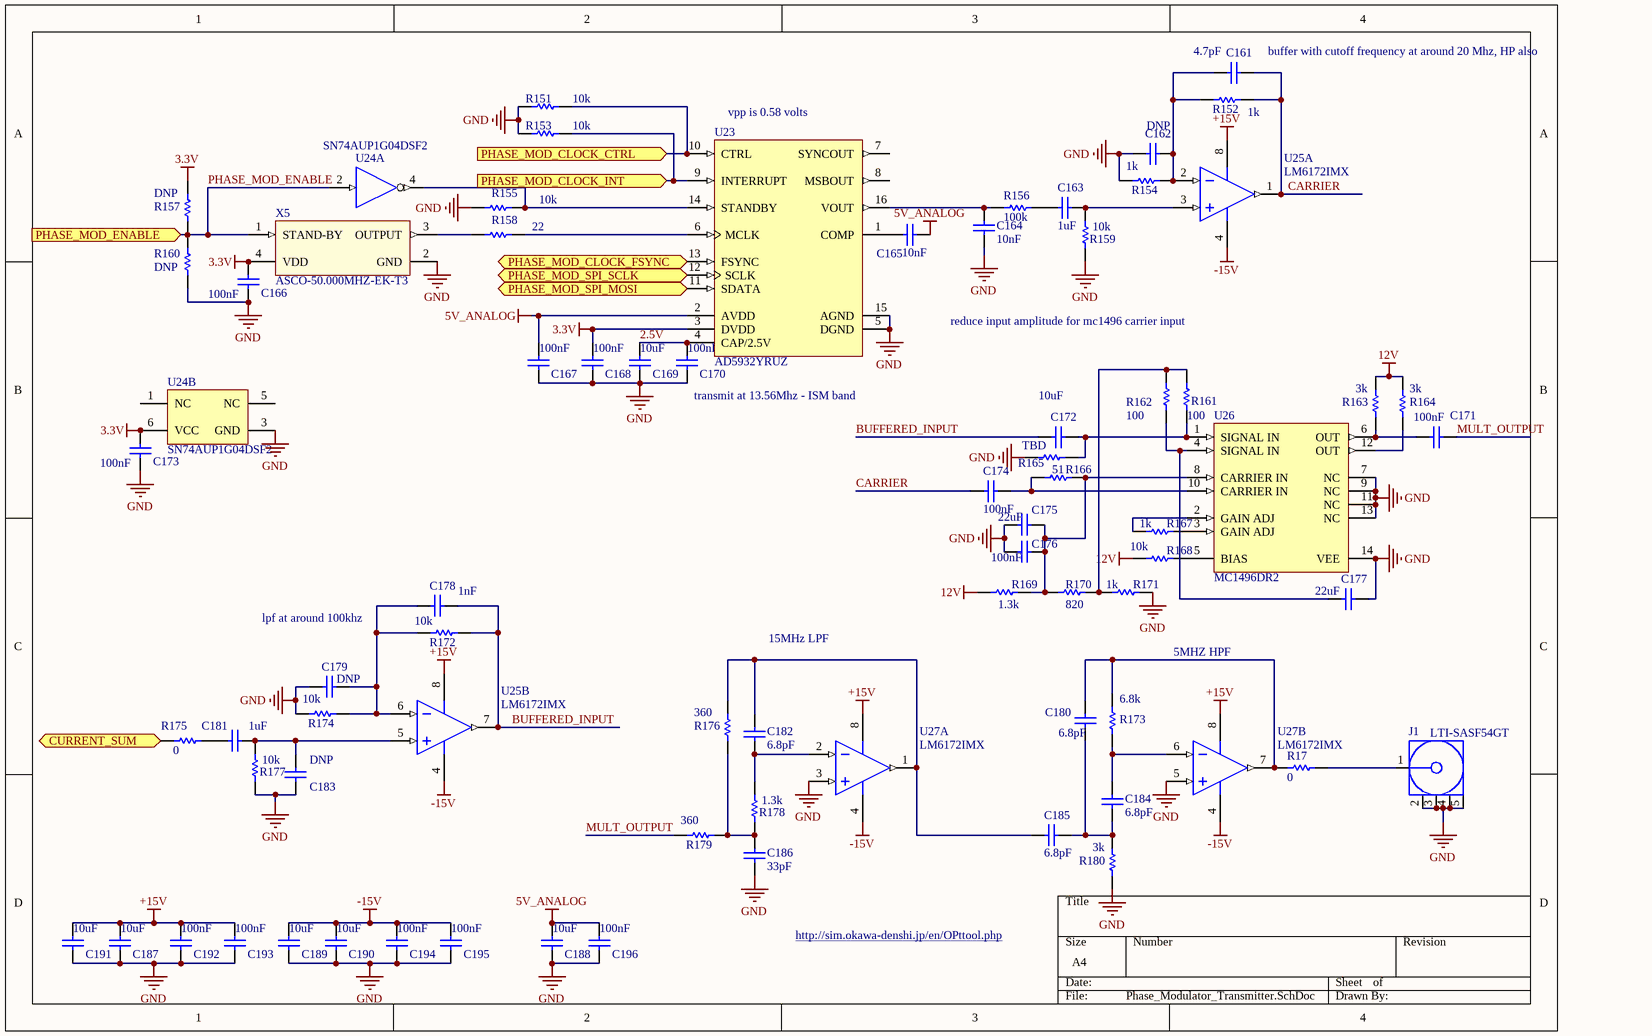
[diagram p10: Phase_Modulator_Transmitter.SchDoc]

### Parts
C161  value 4.7pF  [CAPC0402(1005)60_L]  (hidden comment: CAP0402)
C162  value DNP  [CAPC0402(1005)60_L]  (hidden comment: CAP0402)
C163  value 1uF  [CAPC0402(1005)60_L]  (hidden comment: CAP0402)
C164  value 10nF  [CAPC0402(1005)60_L]  (hidden comment: CAP0402)
C165  value 10nF  [CAPC0402(1005)60_L]  (hidden comment: CAP0402)
C166  value 100nF  [CAPC0402(1005)60_L]  (hidden comment: CAP0402)
C167  value 100nF  [CAPC0402(1005)60_L]  (hidden comment: CAP0402)
C168  value 100nF  [CAPC0402(1005)60_L]  (hidden comment: CAP0402)
C169  value 10uF  [CAPC0402(1005)60_L]  (hidden comment: CAP0402)
C170  value 100nF  [CAPC0402(1005)60_L]  (hidden comment: CAP0402)
C171  Tolerance: 100nF  [CAPC0402(1005)60_L]  (hidden comment: CAP0402)
C172  value 10uF  [CAPC0805(2012)145_L]  (hidden comment: CAP0805)
C173  value 100nF  [CAPC0402(1005)60_L]  (hidden comment: CAP0402)
C174  value 100nF  [CAPC0402(1005)60_L]  (hidden comment: CAP0402)
C175  value 22uF  [CAPC0805(2012)145_L]  (hidden comment: CAP0805)
C176  value 100nF  [CAPC0402(1005)60_L]  (hidden comment: CAP0402)
C177  value 22uF  [CAPC0805(2012)145_L]  (hidden comment: CAP0805)
C178  value 1nF  [CAPC0402(1005)60_L]  (hidden comment: CAP0402)
C179  value DNP  [CAPC0402(1005)60_L]  (hidden comment: CAP0402)
C180  value 6.8pF  [CAPC0402(1005)60_L]  (hidden comment: CAP0402)
C181  value 1uF  [CAPC0402(1005)60_L]  (hidden comment: CAP0402)
C182  value 6.8pF  [CAPC0402(1005)60_L]  (hidden comment: CAP0402)
C183  value DNP  [CAPC0402(1005)60_L]  (hidden comment: CAP0402)
C184  value 6.8pF  [CAPC0402(1005)60_L]  (hidden comment: CAP0402)
C185  value 6.8pF  [CAPC0402(1005)60_L]  (hidden comment: CAP0402)
C186  value 33pF  [CAPC0402(1005)60_L]  (hidden comment: CAP0402)
C187  value 10uF  [CAPC0805(2012)145_L]  (hidden comment: CAP0805)
C188  value 10uF  [CAPC0805(2012)145_L]  (hidden comment: CAP0805)
C189  value 10uF  [CAPC0805(2012)145_L]  (hidden comment: CAP0805)
C190  value 10uF  [CAPC0805(2012)145_L]  (hidden comment: CAP0805)
C191  value 10uF  [CAPC0805(2012)145_L]  (hidden comment: CAP0805)
C192  value 100nF  [CAPC0402(1005)60_L]  (hidden comment: CAP0402)
C193  value 100nF  [CAPC0402(1005)60_L]  (hidden comment: CAP0402)
C194  value 100nF  [CAPC0402(1005)60_L]  (hidden comment: CAP0402)
C195  value 100nF  [CAPC0402(1005)60_L]  (hidden comment: CAP0402)
C196  value 100nF  [CAPC0402(1005)60_L]  (hidden comment: CAP0402)
J1  LTI-SASF54GT  [LHT-LTI-SASF54GT_V]
R17  value 0  [RESC0402(1005)_L]  (hidden comment: RES0402)
R151  value 10k  [RESC0402(1005)_L]  (hidden comment: RES0402)
R152  value 1k  [RESC0402(1005)_L]  (hidden comment: RES0402)
R153  value 10k  [RESC0402(1005)_L]  (hidden comment: RES0402)
R154  value 1k  [RESC0402(1005)_L]  (hidden comment: RES0402)
R155  value 10k  [RESC0402(1005)_L]  (hidden comment: RES0402)
R156  value 100k  [RESC0402(1005)_L]  (hidden comment: RES0402)
R157  value DNP  [RESC0402(1005)_L]  (hidden comment: RES0402)
R158  value 22  [RESC0402(1005)_L]  (hidden comment: RES0402)
R159  value 10k  [RESC0402(1005)_L]  (hidden comment: RES0402)
R160  value DNP  [RESC0402(1005)_L]  (hidden comment: RES0402)
R161  value 100  [RESC0402(1005)_L]  (hidden comment: RES0402)
R162  value 100  [RESC0402(1005)_L]  (hidden comment: RES0402)
R163  value 3k  [RESC0402(1005)_L]  (hidden comment: RES0402)
R164  value 3k  [RESC0402(1005)_L]  (hidden comment: RES0402)
R165  value TBD  [RESC0402(1005)_L]  (hidden comment: RES0402)
R166  value 51  [RESC0402(1005)_L]  (hidden comment: RES0402)
R167  value 1k  [RESC0402(1005)_L]  (hidden comment: RES0402)
R168  value 10k  [RESC0402(1005)_L]  (hidden comment: RES0402)
R169  value 1.3k  [RESC0402(1005)_L]  (hidden comment: RES0402)
R170  value 820  [RESC0402(1005)_L]  (hidden comment: RES0402)
R171  value 1k  [RESC0402(1005)_L]  (hidden comment: RES0402)
R172  value 10k  [RESC0402(1005)_L]  (hidden comment: RES0402)
R173  value 6.8k  [RESC0402(1005)_L]  (hidden comment: RES0402)
R174  value 10k  [RESC0402(1005)_L]  (hidden comment: RES0402)
R175  value 0  [RESC0402(1005)_L]  (hidden comment: RES0402)
R176  value 360  [RESC0402(1005)_L]  (hidden comment: RES0402)
R177  value 10k  [RESC0402(1005)_L]  (hidden comment: RES0402)
R178  value 1.3k  [RESC0402(1005)_L]  (hidden comment: RES0402)
R179  value 360  [RESC0402(1005)_L]  (hidden comment: RES0402)
R180  value 3k  [RESC0402(1005)_L]  (hidden comment: RES0402)
U23  AD5932YRUZ  [ADI-RU-16_M]
U24  SN74AUP1G04DSF2  [DSF0006A_V]  (parts A,B of 2)
U25  LM6172IMX  [D0008A_L]  (parts A,B of 2)
U26  MC1496DR2  [ONSC-SOIC-14-751A-03_H_V]
U27  LM6172IMX  [D0008A_L]  (parts A,B of 2)
X5  ASCO-50.000MHZ-EK-T3  [ABRA-ASCO-50.000MHZ-EK-T3-4_V]

### Ports
CURRENT_SUM (in), PHASE_MOD_CLOCK_CTRL (in), PHASE_MOD_CLOCK_FSYNC (in), PHASE_MOD_CLOCK_INT (in), PHASE_MOD_ENABLE (in), PHASE_MOD_SPI_MOSI (in), PHASE_MOD_SPI_SCLK (in)

### Nets
3.3V: C166.1 C168.1 C173.1 R157.2 U23.3(DVDD) U24.6(VCC) X5.4(VDD)
5V_ANALOG: C165.2 C167.1 C188.2 C196.1 U23.2(AVDD)
12V: R163.1 R164.1 R168.2 R169.2
+15V: C187.2 C191.2 C192.1 C193.1 U25.8(V+) U27.8(V+)
-15V: C189.2 C190.2 C194.1 C195.1 U25.4(V-) U27.4(V-)
GND: C162.1 C164.1 C166.2 C167.2 C168.2 C169.2 C170.2 C173.2 C175.1 C176.1 C177.2 C179.1 C183.2 C186.2 C187.1 C188.1 C189.1 C190.1 C191.1 C192.2 C193.2 C194.2 C195.2 C196.2 J1.2 J1.3 J1.4 J1.5 R151.2 R153.2 R154.1 R155.2 R159.1 R160.1 R165.1 R171.1 R174.1 R177.2 R180.2 U23.5(DGND) U23.15(AGND) U24.3(GND) U26.7(NC) U26.9(NC) U26.11(NC) U26.13(NC) U26.14(VEE) U27.3(INA+) U27.5(INB+) X5.2(GND)
2.5V: C169.1 C170.1 U23.4(CAP/2.5V)
ADC_OUTC0: R175.1 ; port CURRENT_SUM
BUFFERED_INPUT: C172.1 C178.2 R172.2 U25.7(OUTB)
CARRIER: C161.2 C174.1 R152.2 U25.1(OUTA)
DIN: U23.11(SDATA) ; port PHASE_MOD_SPI_MOSI
MULT_OUTPUT: C171.2 R179.1
PB13: U23.12(SCLK) ; port PHASE_MOD_SPI_SCLK
PC0: R151.1 U23.10(CTRL) ; port PHASE_MOD_CLOCK_CTRL
PC1: R153.1 U23.9(INTERRUPT) ; port PHASE_MOD_CLOCK_INT
PC3: U23.13(FSYNC) ; port PHASE_MOD_CLOCK_FSYNC
PHASE_MOD_ENABLE: R157.1 R160.2 U24.2(A) X5.1(STAND-BY) ; port PHASE_MOD_ENABLE  [project net PC2]
NetC161_1: C161.1 C162.2 R152.1 R154.2 U25.2(INA-)
NetC163_1: C163.1 R159.2 U25.3(INA+)
NetC163_2: C163.2 R156.1
NetC164_2: C164.2 R156.2 U23.16(VOUT)
NetC165_1: C165.1 U23.1(COMP)
NetC171_1: C171.1 R163.2 U26.6(OUT)
NetC172_2: C172.2 R161.2 R165.2 U26.1(SIGNAL_IN)
NetC174_2: C174.2 R166.2 U26.10(CARRIER_IN)
NetC175_2: C175.2 C176.2 R166.1 R169.1 R170.2 U26.8(CARRIER_IN)
NetC177_1: C177.1 R162.2 U26.4(SIGNAL_IN)
NetC178_1: C178.1 C179.2 R172.1 R174.2 U25.6(INB-)
NetC180_1: C180.1 C184.1 C185.1 R180.1
NetC180_2: C180.2 R17.1 R173.1 U27.7(OUTB)
NetC181_1: C181.1 R175.2
NetC181_2: C181.2 C183.1 R177.1 U25.5(INB+)
NetC182_1: C182.1 R178.2 U27.2(INA-)
NetC182_2: C182.2 C185.2 R176.2 U27.1(OUTA)
NetC184_2: C184.2 R173.2 U27.6(INB-)
NetC186_1: C186.1 R176.1 R178.1 R179.2
NetJ1_1: J1.1 R17.2
NetR155_1: R155.1 U23.14(STANDBY) U24.4(Y)
NetR158_1: R158.1 U23.6(MCLK)
NetR158_2: R158.2 X5.3(OUTPUT)
NetR161_1: R161.1 R162.1 R170.1 R171.2
NetR164_2: R164.2 U26.12(OUT)
NetR167_1: R167.1 U26.3(GAIN_ADJ)
NetR167_2: R167.2 U26.2(GAIN_ADJ)
NetR168_1: R168.1 U26.5(BIAS)

Not connected (* = marked no-connect by the designer): U23 7(SYNCOUT) 8(MSBOUT); U24 1(NC) 5(NC)

### Notes on the sheet
- (near U23) vpp is 0.58 volts
- buffer with cutoff frequency at around 20 Mhz, HP also
- reduce input amplitude for mc1496 carrier input
- (near C170) transmit at 13.56Mhz - ISM band
- lpf at around 100khz
- 15MHz LPF
- 5MHZ HPF
- http://sim.okawa-denshi.jp/en/OPttool.php

### Library data of the parts
C161-C171 C173 C174 C176 C178-C186 C192-C196 = CMP-1590-00004-1: as C123-C133 on sheet MCU_USB; PackageReference: CAPC0402(1005)60
C172 C175 C177 C187-C191 = CMP-1590-00003-1: as C143 on sheet MCU_USB; PackageReference: CAPC0805(2012)145
J1 = CMP-1713-00001-1: SMA Connector, Pitch 2.54 mm, 1 Position, Height 9.5 mm, Tail Length 4 mm, RoHS; Manufacturer: Lighthorse Technologies Inc.; ComponentLink2Description: Datasheet; Mounting Technology: Through Hole; ComponentLink1Description: Manufacturer URL; PackageDescription: SMA Connector, Pitch 2.54 mm, 1 Position, Height 9.5 mm, Tail Length 4 mm; PartNumber: LTI-SASF54GT; PackageReference: LTI-SASF54GT; DatasheetVersion: Rev. May-99; ComponentLink2URL: http://rfconnector.com/sheets/SASF54GT.pdf; ComponentLink1URL: http://www.rfconnector.com
R17 R151-R180 = CMP-1591-00004-1: as R121-R125 on sheet MCU_USB; PackageReference: RESC0402(1005)
U23 = CMP-0293-00067-1: Programmable Frequency Scan Waveform Generator, 10-Bit, Serial, RU-16, 96 Tube, Pb-Free; I Supply total (max): 8mA; REFCLK Multiplier: Yes; Tuning Word Width (bits): 24bit; Resolution (Bits): 10bit; Master fclk: 50MHz; PackageVersion: Nov-2002; ComponentLink3Description: Package Specification; Code_JEDEC: MO-153AB; ComponentLink2Description: Datasheet; PackageDescription: 16-Lead Thin Shrink Small Outline Package [TSSOP]; DatasheetVersion: Rev. 0; I/O Interface: Serial; PackageReference: RU-16; ComponentLink1URL: www.analog.com; ComponentLink1Description: Manufacturer URL; ComponentLink2URL: http://www.analog.com/static/imported-files/data_sheets/AD5932.pdf; ComponentLink3URL: http://www.analog.com/static/imported-files/packages/36244347913743854010197452789RU16.pdf
U24 = CMP-0859-00902-3: Low-Power Single Inverter Gate, DSF0006A, LARGE T&R; Manufacturer: Texas Instruments; Output Drive (IOL/IOH)(Max)(mA): 20/-20; tpd @ Nom Voltage(Max)(ns): 25.4,16,10.8,9.2,6.5,5.4; VCC(Max)(V): 3.6; VCC(Min)(V): 0.8; Output Type: CMOS; Bits(#): 1; Sub-Family: Inverting Buffer/Driver; Voltage(Nom)(V): 0.8,1.2,1.5,1.8,2.5,3.3; Schmitt Trigger: No; F @ Nom Voltage(Max)(Mhz): 100; Rating: Catalog; ICC @ Nom Voltage(Max)(mA): 0.0009; Logic: Inverting; Technology Family: AUP; PackageReference: DSF0006A; Operating Temperature Range(C): -40 to 85; Generic Part Number: SN74AUP1G04; Input Type: CMOS; 3-State Output: No; DatasheetVersion: SCES571K
U25 U27 = CMP-0055-00808-3: Dual High Speed, Low Power, Low Distortion Voltage Feedback Amplifiers, 8-pin Narrow SOIC; Manufacturer: Texas Instruments; PackageTopMarking: NSZXTT*LM61*72IM; PowerWise: Y; ComponentLink1URL: http://www.ti.com/general/docs/lit/getliterature.tsp?genericPartNumber=LM6172&fileType=pdf; ComponentLink1Description: Datasheet URL; RoHS: N; Code_IPC: SOIC127P600-8; PackageDescription: SOIC Narrow, 4.9 x 3.9 x 1.45mm, 8 Lead, 1.27mm Pitch; PinCount: 8; CompType: Amplifiers; Code_JEDEC: MS-012-AA; Package Reference: D0008A
U26 = CMP-1320-00014-1: Balanced Modulator / Demodulator, 0 to 70 degC, 14-Pin SOIC, Tape and Reel; Manufacturer: On Semiconductor; ComponentLink2URL: http://www.onsemi.com/pub/Collateral/MC1496-D.PDF; ComponentLink1URL: http://www.onsemi.com/; Operating Temp Max: 70 degC; RoHS: FALSE; ComponentLink1Description: Manufacturer URL; PackageDescription: 14-Pin Small Outline Integrated Circuit, Body 8.65 x 3.9 mm, Pitch 1.27 mm; PackageVersion: Rev. H; ComponentLink3Description: Package Specification; ComponentLink2Description: Datasheet; Mounting Technology: Surface Mount; ComponentLink3URL: http://www.onsemi.com/pub_link/Collateral/MC74AC74-D.PDF; Operating Temp Min: 0 degC; Packing: Tape and Reel; PackageReference: SOIC-14-751A-03_H; DatasheetVersion: Rev. 10; PartNumber: MC1496DR2
X5 = CMP-0461-00001-3: Crystal Clock Oscillator, 50 MHz, -20 to 70 degC, 1.6 x 1.2 x 0.7 mm SMD; Manufacturer: Abracon; Frequency(MHz): 50; Aging: -3 to 3 3 ppm; Packing: Tape and Reel; Overall Frequency Stability: +/-30 ppm; Supply Current (Idd)
into 15pF Load: 6 mA; Supply Voltage (Vdd): 3.3 V; Output Load: 15 pF; ComponentLink2Description: Datasheet; ComponentLink3Description: Package Specification; ComponentLink3URL: http://www.abracon.com/Oscillators/ASCO.pdf; ComponentLink2URL: http://www.abracon.com/Oscillators/ASCO.pdf; Mounting Technology: Surface Mount; PackageDescription: 4-Pin Hand Drawn, Body 1.6 x 1.2 mm; DatasheetVersion: 01.25.13; ComponentLink1Description: Manufacturer URL; PartNumber: ASCO-50.000MHZ-EK-T3; Operating temperature: -20 to 70 degC; ComponentLink1URL: http://www.abracon.com; PackageReference: ASCO-50.000MHZ-EK-T3-4

## Sheet INPUTS_OUTPUTS.SchDoc
size A3
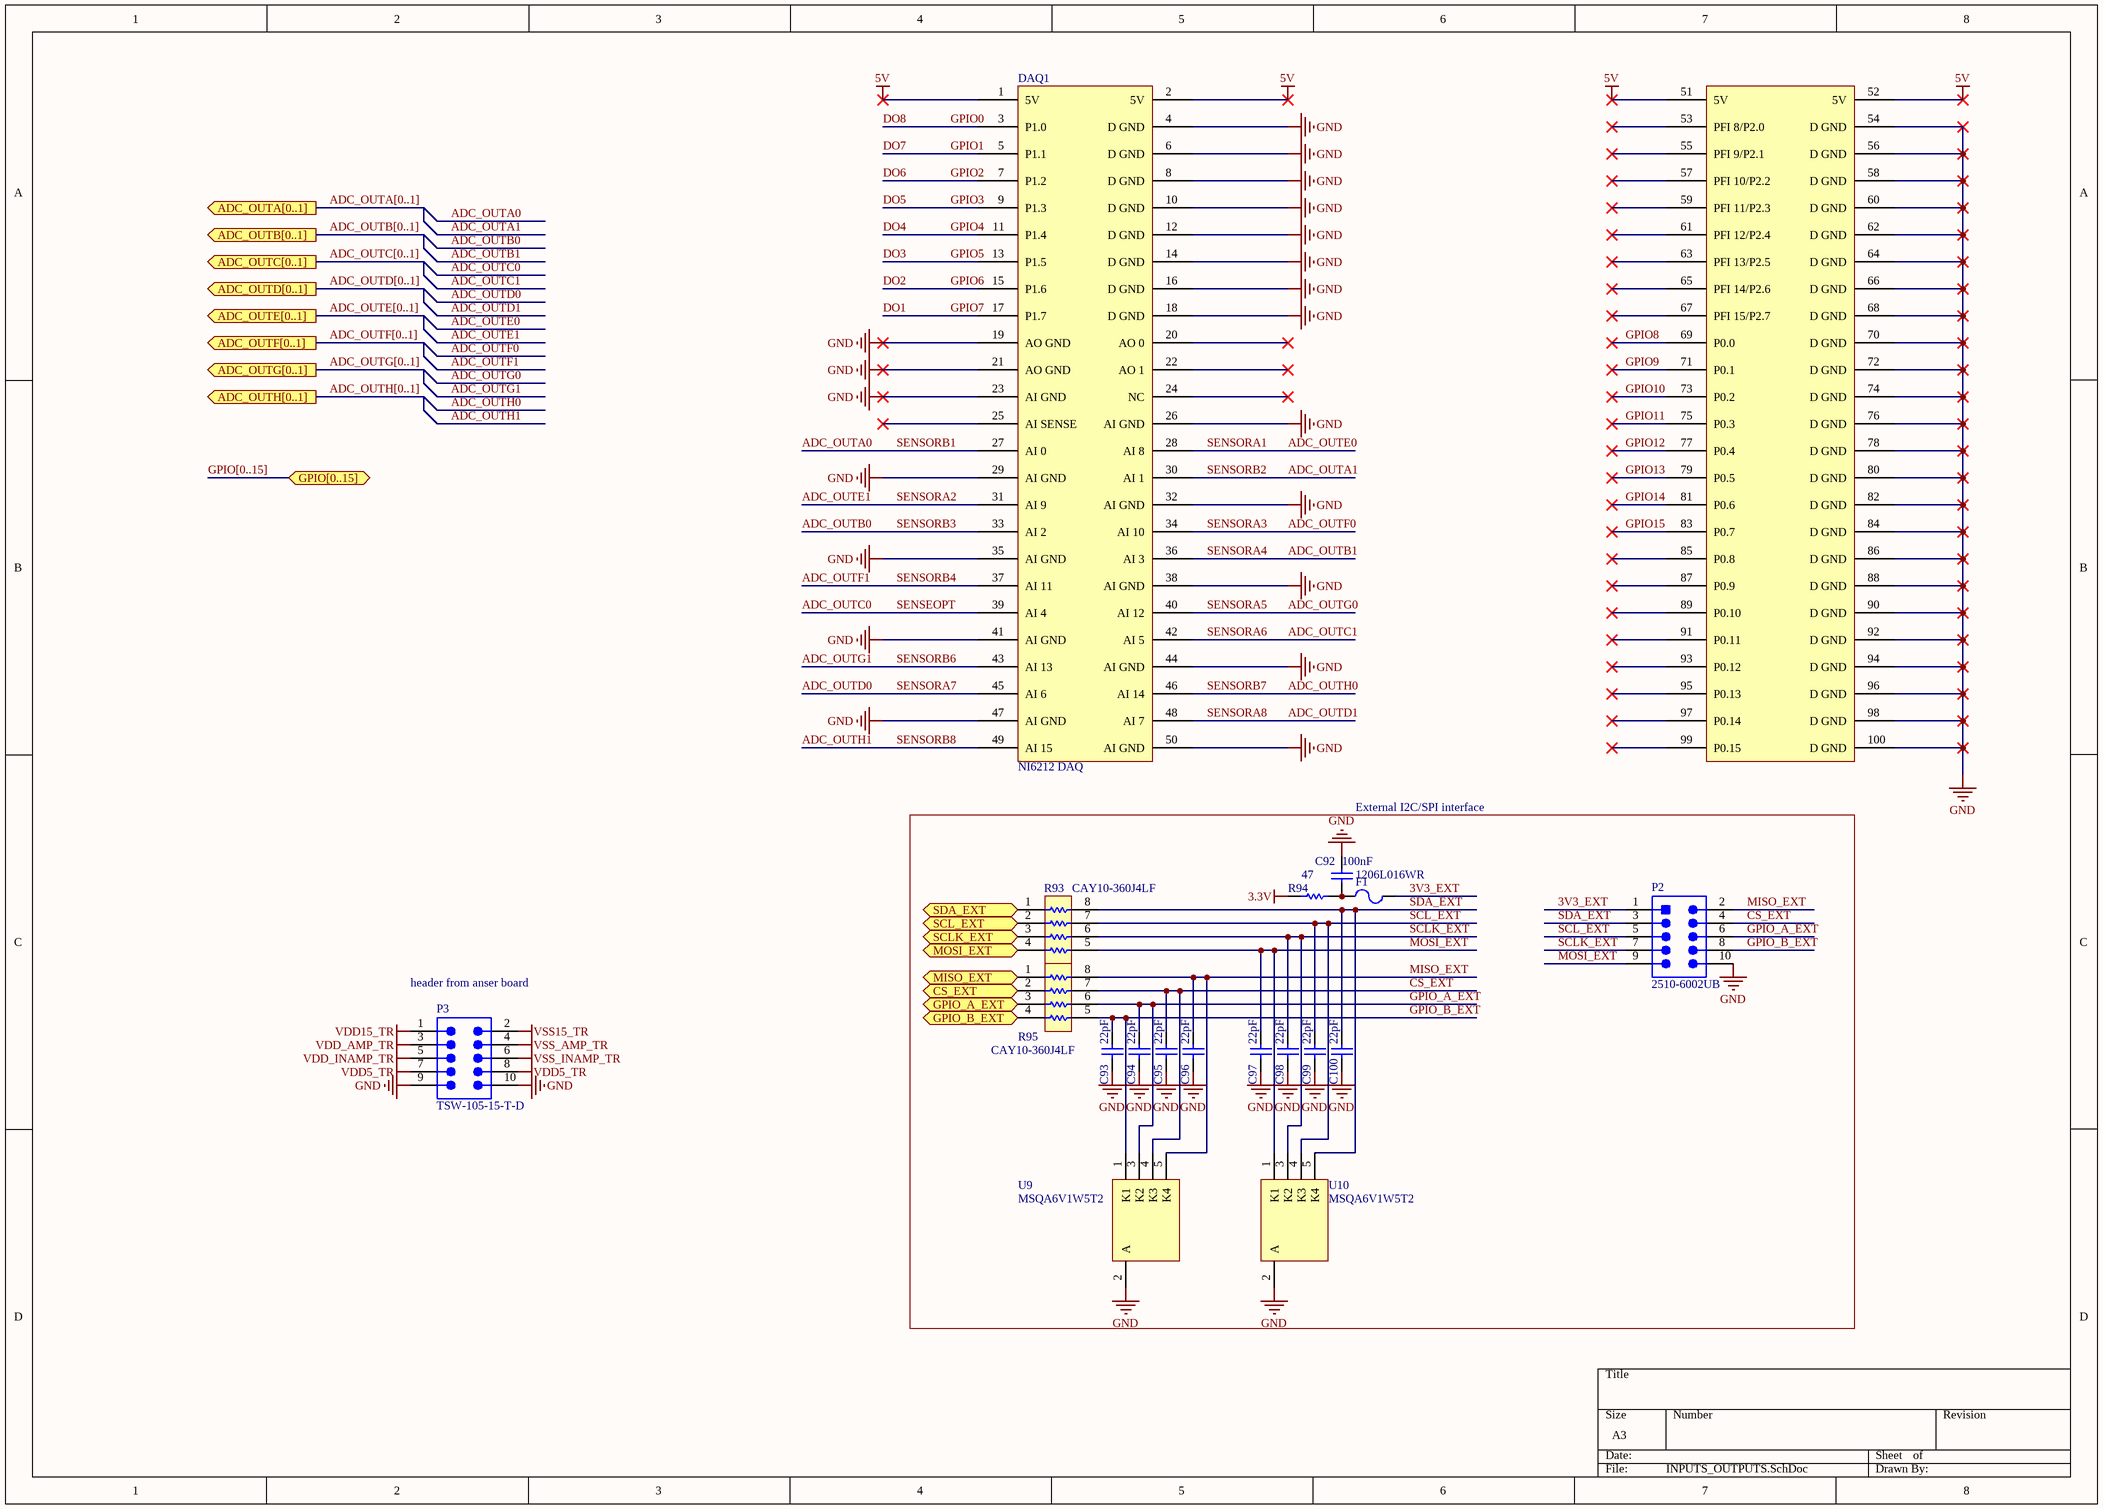
[diagram p11: INPUTS_OUTPUTS.SchDoc]

### Parts
C92  value 100nF  [CAPC0402(1005)60_L]  (hidden comment: CAP0402)
C93  value 22pF  [CAPC0402(1005)60_L]  (hidden comment: CAP0402)
C94  value 22pF  [CAPC0402(1005)60_L]  (hidden comment: CAP0402)
C95  value 22pF  [CAPC0402(1005)60_L]  (hidden comment: CAP0402)
C96  value 22pF  [CAPC0402(1005)60_L]  (hidden comment: CAP0402)
C97  value 22pF  [CAPC0402(1005)60_L]  (hidden comment: CAP0402)
C98  value 22pF  [CAPC0402(1005)60_L]  (hidden comment: CAP0402)
C99  value 22pF  [CAPC0402(1005)60_L]  (hidden comment: CAP0402)
C100  value 22pF  [CAPC0402(1005)60_L]  (hidden comment: CAP0402)
DAQ1  NI6212 DAQ  [OUTPUT_CONNECTORS]
F1  1206L016WR  [LFUS-1206L016WR_V]
P2  2510-6002UB  [3M-2510-6002_V]
P3  TSW-105-15-T-D  [SMTC-TSW-105-15-X-D]
R93  CAY10-360J4LF  [BOUR-CAY10-J4_V]
R94  value 47  [RESC0402(1005)_L]  (hidden comment: RES0402)
R95  CAY10-360J4LF  [BOUR-CAY10-J4_V]
U9  MSQA6V1W5T2  [ONSC-SC70-5-419A-02_V]
U10  MSQA6V1W5T2  [ONSC-SC70-5-419A-02_V]

### Blocks framed on the sheet
External I2C/SPI interface: C92-C100 F1 P2 R93-R95 U9 U10

### Ports
ADC_OUTA[0..1] (out), ADC_OUTB[0..1] (out), ADC_OUTC[0..1] (out), ADC_OUTD[0..1] (out), ADC_OUTE[0..1] (out), ADC_OUTF[0..1] (out), ADC_OUTG[0..1] (out), ADC_OUTH[0..1] (out), CS_EXT, GPIO[0..15] (bidir), GPIO_A_EXT, GPIO_B_EXT, MISO_EXT (in), MOSI_EXT (out), SCL_EXT (out), SCLK_EXT (out), SDA_EXT (bidir)

### Nets
3.3V: R94.1
5V: DAQ1.1(5V) DAQ1.2(5V) DAQ1.51(5V) DAQ1.52(5V)
GND: C92.1 C93.2 C94.2 C95.2 C96.2 C97.2 C98.2 C99.2 C100.2 DAQ1.4(D_GND) DAQ1.6(D_GND) DAQ1.8(D_GND) DAQ1.10(D_GND) DAQ1.12(D_GND) DAQ1.14(D_GND) DAQ1.16(D_GND) DAQ1.18(D_GND) DAQ1.19(AO_GND) DAQ1.21(AO_GND) DAQ1.23(AI_GND) DAQ1.26(AI_GND) DAQ1.29(AI_GND) DAQ1.32(AI_GND) DAQ1.35(AI_GND) DAQ1.38(AI_GND) DAQ1.41(AI_GND) DAQ1.44(AI_GND) DAQ1.47(AI_GND) DAQ1.50(AI_GND) DAQ1.54(D_GND) DAQ1.56(D_GND) DAQ1.58(D_GND) DAQ1.60(D_GND) DAQ1.62(D_GND) DAQ1.64(D_GND) DAQ1.66(D_GND) DAQ1.68(D_GND) DAQ1.70(D_GND) DAQ1.72(D_GND) DAQ1.74(D_GND) DAQ1.76(D_GND) DAQ1.78(D_GND) DAQ1.80(D_GND) DAQ1.82(D_GND) DAQ1.84(D_GND) DAQ1.86(D_GND) DAQ1.88(D_GND) DAQ1.90(D_GND) DAQ1.92(D_GND) DAQ1.94(D_GND) DAQ1.96(D_GND) DAQ1.98(D_GND) DAQ1.100(D_GND) P2.10 P3.9 P3.10 U9.2(A) U10.2(A)
VDD5_TR: P3.7 P3.8
VDD15_TR: P3.1
VDD_AMP_TR: P3.3
VDD_INAMP_TR: P3.5
VSS15_TR: P3.2
VSS_AMP_TR: P3.4
VSS_INAMP_TR: P3.6
3V3_EXT: F1.2 P2.1
ADC_OUTA0: DAQ1.27(AI_0)  [also labelled SENSORB1]
ADC_OUTA1: DAQ1.30(AI_1)  [also labelled SENSORB2]  [project net ADC_INPUT0]
ADC_OUTB0: DAQ1.33(AI_2)  [also labelled SENSORB3]
ADC_OUTB1: DAQ1.36(AI_3)  [also labelled SENSORA4]  [project net ADC_INPUT1]
ADC_OUTC0: DAQ1.39(AI_4)  [also labelled SENSEOPT]
ADC_OUTC1: DAQ1.42(AI_5)  [also labelled SENSORA6]  [project net ADC_INPUT2]
ADC_OUTD0: DAQ1.45(AI_6)  [also labelled SENSORA7]
ADC_OUTD1: DAQ1.48(AI_7)  [also labelled SENSORA8]  [project net ADC_INPUT3]
ADC_OUTE0: DAQ1.28(AI_8)  [also labelled SENSORA1]
ADC_OUTE1: DAQ1.31(AI_9)  [also labelled SENSORA2]  [project net ADC_INPUT4]
ADC_OUTF0: DAQ1.34(AI_10)  [also labelled SENSORA3]
ADC_OUTF1: DAQ1.37(AI_11)  [also labelled SENSORB4]  [project net ADC_INPUT5]
ADC_OUTG0: DAQ1.40(AI_12)  [also labelled SENSORA5]
ADC_OUTG1: DAQ1.43(AI_13)  [also labelled SENSORB6]  [project net ADC_INPUT6]
ADC_OUTH0: DAQ1.46(AI_14)  [also labelled SENSORB7]
ADC_OUTH1: DAQ1.49(AI_15)  [also labelled SENSORB8]  [project net ADC_INPUT7]
CS_EXT: C95.1 P2.4 R95.7 U9.4(K3)
DO1: DAQ1.17(P1.7)  [also labelled GPIO7]  [project net 5V_BUS7]
DO2: DAQ1.15(P1.6)  [also labelled GPIO6]  [project net 5V_BUS6]
DO3: DAQ1.13(P1.5)  [also labelled GPIO5]  [project net 5V_BUS5]
DO4: DAQ1.11(P1.4)  [also labelled GPIO4]  [project net 5V_BUS4]
DO5: DAQ1.9(P1.3)  [also labelled GPIO3]  [project net 5V_BUS3]
DO6: DAQ1.7(P1.2)  [also labelled GPIO2]  [project net 5V_BUS2]
DO7: DAQ1.5(P1.1)  [also labelled GPIO1]  [project net 5V_BUS1]
DO8: DAQ1.3(P1.0)  [also labelled GPIO0]  [project net 5V_BUS0]
GPIO8: DAQ1.69(P0.0)  [project net 5V_BUS8]
GPIO9: DAQ1.71(P0.1)  [project net 5V_BUS9]
GPIO10: DAQ1.73(P0.2)  [project net 5V_BUS10]
GPIO11: DAQ1.75(P0.3)  [project net 5V_BUS11]
GPIO12: DAQ1.77(P0.4)  [project net 5V_BUS12]
GPIO13: DAQ1.79(P0.5)  [project net 5V_BUS13]
GPIO14: DAQ1.81(P0.6)  [project net 5V_BUS14]
GPIO15: DAQ1.83(P0.7)  [project net 5V_BUS15]
GPIO_A_EXT: C94.1 P2.6 R95.6 U9.3(K2)
GPIO_B_EXT: C93.1 P2.8 R95.5 U9.1(K1)
INPUT0: R95.4 ; port GPIO_B_EXT
MISO: R95.1 ; port MISO_EXT
MISO_EXT: C96.1 P2.2 R95.8 U9.5(K4)
MOSI: R93.4 ; port MOSI_EXT
MOSI_EXT: C97.1 P2.9 R93.5 U10.1(K1)
OUTPUT1: R95.2 ; port CS_EXT
OUTPUT2: R95.3 ; port GPIO_A_EXT
PE12: R93.3 ; port SCLK_EXT
SCL: R93.2 ; port SCL_EXT
SCL_EXT: C99.1 P2.5 R93.7 U10.4(K3)
SCLK_EXT: C98.1 P2.7 R93.6 U10.3(K2)
SDA: R93.1 ; port SDA_EXT
SDA_EXT: C100.1 P2.3 R93.8 U10.5(K4)
NetC92_2: C92.2 F1.1 R94.2

Not connected (* = marked no-connect by the designer): DAQ1 20(AO_0)* 22(AO_1)* 24(NC)* 25(AI_SENSE)* 53(PFI_8/P2.0)* 55(PFI_9/P2.1)* 57(PFI_10/P2.2)* 59(PFI_11/P2.3)* 61(PFI_12/P2.4)* 63(PFI_13/P2.5)* 65(PFI_14/P2.6)* 67(PFI_15/P2.7)* 85(P0.8)* 87(P0.9)* 89(P0.10)* 91(P0.11)* 93(P0.12)* 95(P0.13)* 97(P0.14)* 99(P0.15)*

### Buses and harness runs
bus ADC_OUTA[0..1] = port ADC_OUTA[0..1]
bus ADC_OUTB[0..1] = port ADC_OUTB[0..1]
bus ADC_OUTC[0..1] = port ADC_OUTC[0..1]
bus ADC_OUTD[0..1] = port ADC_OUTD[0..1]
bus ADC_OUTE[0..1] = port ADC_OUTE[0..1]
bus ADC_OUTF[0..1] = port ADC_OUTF[0..1]
bus ADC_OUTG[0..1] = port ADC_OUTG[0..1]
bus ADC_OUTH[0..1] = port ADC_OUTH[0..1]
bus GPIO[0..15] = port GPIO[0..15]

### Notes on the sheet
- (near P3) header from anser board

### Library data of the parts
C92-C100 = CMP-1590-00004-1: as C123-C133 on sheet MCU_USB; PackageReference: CAPC0402(1005)60
DAQ1 = NI6212_OUTPUT_CONNECTIONS: DAQ Unit; Published: 8-Jun-2000; Publisher: National Instruments
F1 = CMP-2000-05471-1: Resettable Fuse, 30 V, 100 A, 4.5 Ohm, -40 to 85 degC, 1206 (3216 Metric), RoHS, Tape and Reel; Manufacturer: Littelfuse; Hold Current [Ih]: 0.16A; Trip Current: 0.37A; Working Voltage-Max: 30V; Datasheet Version: 08/2016; Size: 1206; Manufacturer URL: http://www.littelfuse.com/; Datasheet URL: http://www.littelfuse.com/~/media/electronics/datasheets/resettable_ptcs/littelfuse_ptc_1206l_datasheet.pdf.pdf; Mounting Technology: SurfaceMount; Package Reference: 1206L016WR; Package Description: 2-Pin Surface Mount Device, Body 3.2 x 1.65 mm, Height 1.45 mm (Max); Operating Temp Range: -40to+85°C
P2 = CMP-2000-05545-1: Male Header, Pitch 2.54 mm, 2 x 5 Position, Height 9.91 mm, Tail Length 2.84 mm, -55 to 105 degC, RoHS, Bulk; Manufacturer: 3M; Associated Product: 3505-33(1000BX)-ND / -CONNEJECTORLATCHLONGSNAP-IN; Pitch: 0.100"(2.54mm); Catalog Drawings: 6002UB,RBSeries; Dynamic Catalog: 2500Series; Connector Type: Header,Shrouded; Other Names: 5400782713 / 54007827139 / 80-6105-6503-0 / 80610565030 / MHB10G / MHB10K; Product Training Modules: IDCWiremountConnectorsPrimer; Number of Positions Loaded: All; Mating Products: CHG-2010-S01010-KEP-ND / -CONNRCPTIDC10POS24-22AWG / 3M11964-ND / -CONNSOCKET10POSIDCW/STRREL / 89110-0003-ND / -CONNSOCKET10POSIDCW/STRREL / 5110-B7A2PL-ND / -10/2R/BMSKT/.100 / MKC10E-ND / -CONN10POSIDCSOCKET10AUW/POL / MSC10E-ND / -CONN10POSIDCSOCKET15GOLD / D89110-0101HK-ND / -CONN10POSIDCSOCKETGOLDW/POL / D89110-0001HK-ND / -CONN10POSIDCSOCKETGOLD / MSPV10-ND / -CONNSOCKETPCBVERT10POS.1" / 3M9088-ND / -CONNRECEPTIDC10POS24-22AWG / More...; Number of Positions: 10; Category: Connectors,Interconnects; Datasheet Version: Rev. M, 08/2014; Datasheet URL: http://multimedia.3m.com/mws/media/330367O/3mtm-100-in-4-wall-hdr-rohs-lp-straightra-hitemp-ts0770.pdf; Series: 2500; Contact Finish: Gold; Number of Rows: 2; Standard Package: 784; Color: Gray; Package Description: Male Header, Pitch 2.54 mm, 2 x 5 Position, Height 9.91 mm, Tail Length 2.84 mm; Packaging: Bulk; Contact Type: MalePin; Mounting Technology: ThroughHole; Family: RectangularConnectors-Headers,MalePins; Contact Mating Length: 0.243"(6.17mm); Termination: Solder; Row Spacing: 0.100"(2.54mm); Package Reference: 2510-6002; Contact Finish Thickness: 30µin(0.76µm); Mounting Type: ThroughHole; Manufacturer URL: http://www.3m.com/
P3 = CMP-1024-00368-1: Manufacturer: Samtec; Pitch: 2.54 mm; DatasheetVersion: F-214; PackageDescription: .025[0.64] SQ. Post Terminal Strip Assembly; PartNumber: TSW-105-15-T-D; PackageReference: TSW-105-15-X-D; ComponentLink2URL: http://www.samtec.com/documents/webfiles/pdf/TSW_TH.PDF; ComponentLink1URL: http://www.samtec.com; ComponentLink2Description: Datasheet; ComponentLink3Description: Package Specification; PackageVersion: DM, 8/1988; Mounting Technology: Through-hole; Temperature Range: -55 to 105 degC; ComponentLink1Description: Manufacturer URL; RoHS: True; ComponentLink3URL: http://www.samtec.com/documents/webfiles/cpdf/TSW-XXX-XX-XXX-X-XX-XXX-MKT.pdf; Orientation: Vertical
R93 R95 = CMP-1734-00001-1: Chip Resistor Array, 36 Ohm, +/- 5%, 62.5 mW, -55 to 125 degC, 8-Pin SMD, RoHS, Tape and Reel; Power Rating: 120 mW; Resistance: 36 Ohm; Type (Resistor): Thick Film; ComponentLink1URL: http://www.bourns.com/; ComponentLink2Description: Datasheet; Height: 0.018 inch; Mounting Technology: Surface Mount; ComponentLink2URL: http://www.bourns.com/docs/Product-Datasheets/CAY10.pdf; PartNumber: CAY10-360J4LF; Case Code (Metric): 2010; ComponentLink1Description: Manufacturer URL; DatasheetVersion: 01/2015; Width: 0.039 inch; Packaging: Tape and Reel; Pins: 8; RoHSCompliant: true; Mount: Surface Mount; Package Quantity: 10000; Length: 0.079 inch; PackageDescription: 8-Pin Surface Mount Device, Body 2 x 1 mm, Pitch 0.5 mm; Max Operating Temperature: 125 degC; Min Operating Temperature: -55 degC; Case/Package: 0804; Tolerance: 5%
R94 = CMP-1591-00004-1: as R121-R125 on sheet MCU_USB; PackageReference: RESC0402(1005)
U9 U10 = CMP-1060-00060-1: as U16 on sheet MCU_USB; Packing: Tape and Reel; DatasheetVersion: Rev. 7; ComponentLink2URL: http://www.onsemi.com/pub_link/Collateral/MSQA6V1W5T2-D.PDF; PackageDescription: 5-Pin Small Outline Transistor, Body 2 x 1.25 mm, Pitch 0.65 mm; PackageVersion: Rev. L, 01/2013; ComponentLink1URL: http://www.onsemi.com/; ComponentLink2Description: Datasheet; ComponentLink3Description: Package Specification; Mounting Technology: Surface Mount; ComponentLink1Description: Manufacturer URL; PackageReference: SC70-5-419A-02; PartNumber: MSQA6V1W5T2; ComponentLink3URL: http://www.onsemi.cn/pub_link/Collateral/419A-02.PDF